# Altium project CM4 IO_V1.10.PrjPcb (part 4 of 5)

## Sheet 16 MIPI DSI TX.SchDoc: CM4 IO
size 420 x 297 mm; Page Create Date: March  8, 1995; Page Number: 16; Page Size: A3; Comment: radxa_1010; Page Count: 19; RevCode: V1.10; Doc: 16 MIPI DSI TX; DsnPath: D:\WMS\黄工\[RC126]CM4_IO_V1.10\[RC126]_V1.10\CM4 IO_V1.10.DSN; SchematicName: CM4 IO V1.10; PageName: 16 MIPI DSI TX; PageSize: A3; TopSchematic: True
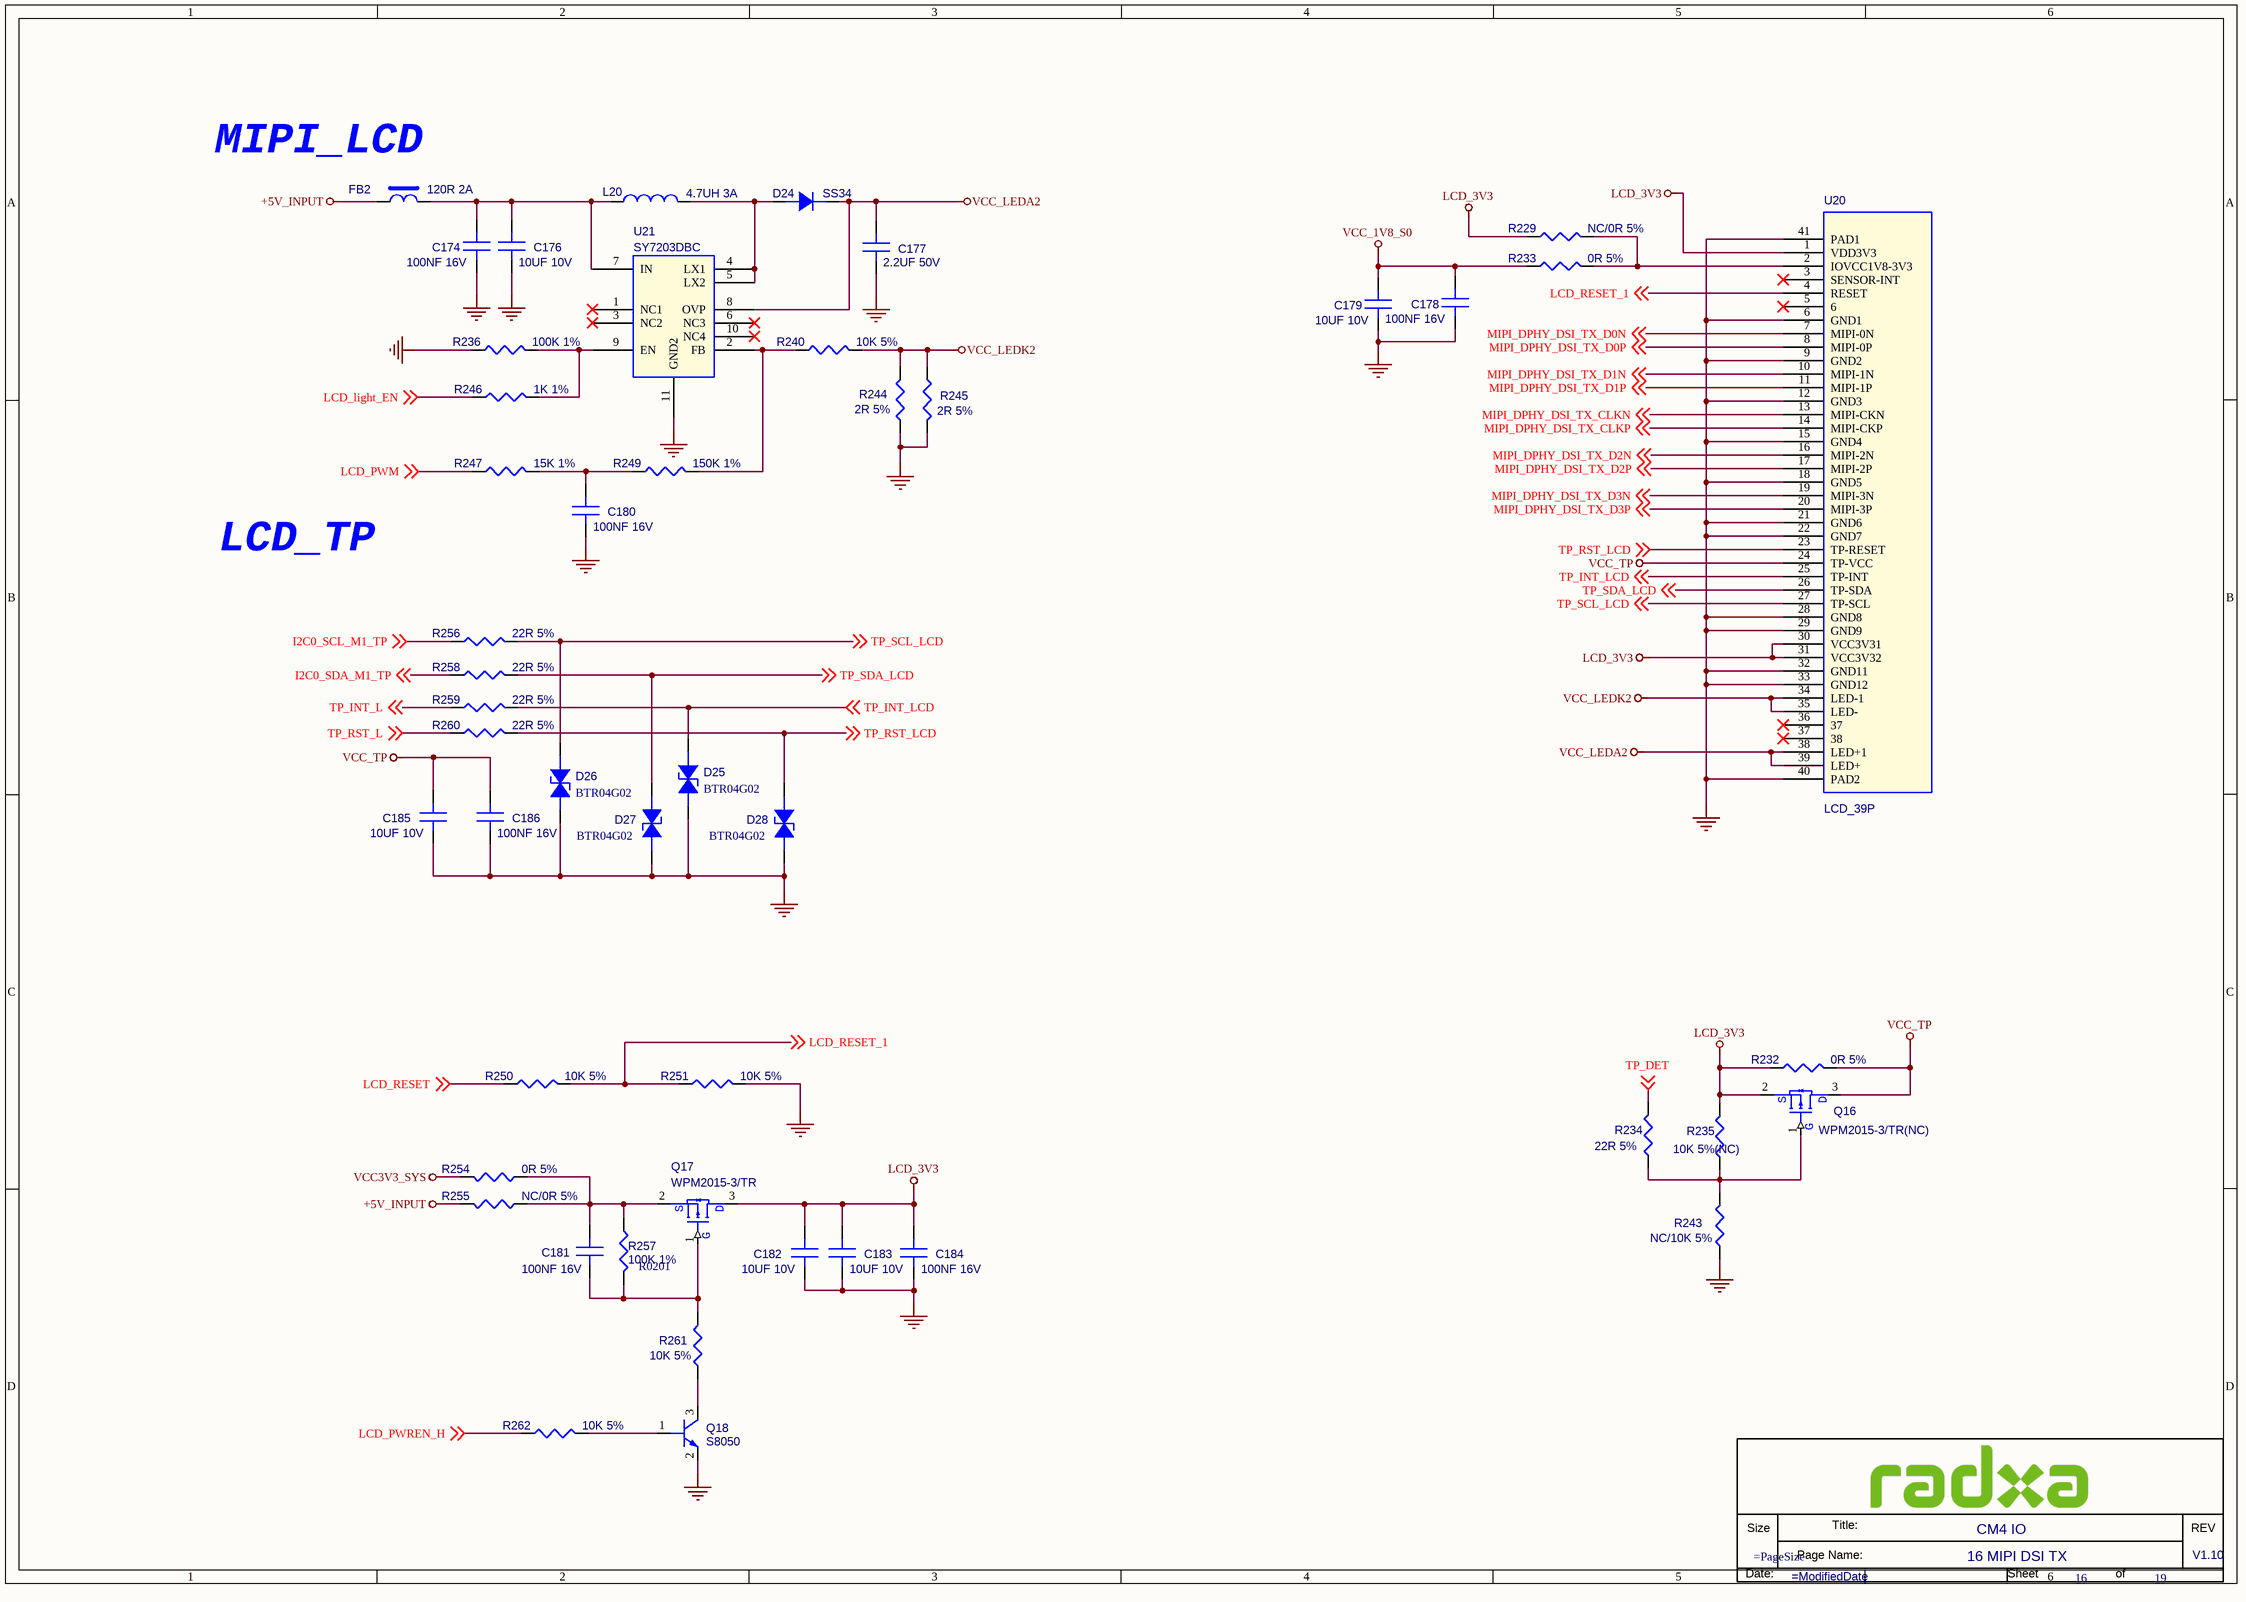
[diagram p13: 16 MIPI DSI TX.SchDoc]

### Parts
(Parts that share a designator on the sheet are numbered #1, #2 ... from top to bottom, then left to right.)
*#14  Doc: 16 MIPI DSI TX  RevCode: V1.10  Title: CM4 IO  Page Number: 16  Page Count: 19  (hidden comment: radxa_1010)  (graphical)
C174  100NF 16V  [C0201]
C176  10UF 10V  [C0603]
C177  2.2UF 50V  [C0603]
C178  100NF 16V  [C0201]
C179  10UF 10V  [C0603]
C180  100NF 16V  [C0201]
C181  100NF 16V  [C0201]
C182  10UF 10V  [C0603]
C183  10UF 10V  [C0603]
C184  100NF 16V  [C0201]
C185  10UF 10V  [C0603]
C186  100NF 16V  [C0201]
D24  SS34  [DO_214AC]
D25  BTR04G02  [DFN1006-2L]
D26  BTR04G02  [DFN1006-2L]
D27  BTR04G02  [DFN1006-2L]
D28  BTR04G02  [DFN1006-2L]
FB2  120R 2A  [FB0603]
L20  4.7UH 3A  [L_3015]
Q16  WPM2015-3/TR(NC)  [SOT_23]
Q17  WPM2015-3/TR  [SOT_23]
Q18  S8050  [SOT_23]
R229  NC/0R 5%  [R0402]
R232  0R 5%  [R0402]
R233  0R 5%  [R0402]
R234  22R 5%  [R0402]
R235  10K 5%(NC)  [R0402]
R236  100K 1%  [R0402]
R240  10K 5%  [R0402]
R243  NC/10K 5%  [R0402]
R244  2R 5%  [R0402]
R245  2R 5%  [R0402]
R246  1K 1%  [R0402]
R247  15K 1%  [R0402]
R249  150K 1%  [R0402]
R250  10K 5%  [R0402]
R251  10K 5%  [R0402]
R254  0R 5%  [R0402]
R255  NC/0R 5%  [R0402]
R256  22R 5%  [R0402]
R257  100K 1%  PCB Footprint: R0201  [R0402]
R258  22R 5%  [R0402]
R259  22R 5%  [R0402]
R260  22R 5%  [R0402]
R261  10K 5%  [R0402]
R262  10K 5%  [R0402]
U20  LCD_39P  [FPC_39P_0D3_LIE]
U21  SY7203DBC  [DFN10_0D5_3]

### Nets
+5V_INPUT: FB2.1 R255.1
GND: C174.2(B) C176.2(B) C177.2(B) C178.2(B) C179.2(B) C180.1(A) C182.2(B) C183.2(B) C184.2(B) C185.2(B) C186.2(B) D25.2(CATHODE) D26.2(CATHODE) D27.2(CATHODE) D28.2(CATHODE) Q18.2(EMITTER) R236.1 R243.1 R244.2 R245.2 R251.2 U20.6(GND1) U20.9(GND2) U20.12(GND3) U20.15(GND4) U20.18(GND5) U20.21(GND6) U20.22(GND7) U20.28(GND8) U20.29(GND9) U20.32(GND11) U20.33(GND12) U20.40(PAD2) U20.41(PAD1) U21.11(GND2)
LCD_3V3: C182.1(A) C183.1(A) C184.1(A) Q16.2(S) Q17.3(D) R229.1 R232.1 R235.2 U20.1(VDD3V3) U20.30(VCC3V31) U20.31(VCC3V32)
VCC3V3_SYS: R254.1
VCC_1V8_S0: C178.1(A) C179.1(A) R233.1
VCC_LEDA2: C177.1(A) D24.2(K) U20.38(LED+1) U20.39(LED+) U21.8(OVP)
VCC_LEDK2: R240.2 R244.1 R245.1 U20.34(LED-1) U20.35(LED-)
VCC_TP: C185.1(A) C186.1(A) Q16.3(D) R232.2 U20.24(TP-VCC)
I2C0_SCL_M1_TP: R256.1 ; off-sheet I2C0_SCL_M1_TP
I2C0_SDA_M1_TP: R258.1 ; off-sheet I2C0_SDA_M1_TP
LCD_light_EN: R246.1 ; off-sheet LCD_light_EN
LCD_PWM: R247.1 ; off-sheet LCD_PWM
LCD_PWREN_H: R262.1 ; off-sheet LCD_PWREN_H
LCD_RESET: R250.1 ; off-sheet LCD_RESET
LCD_RESET_1: R250.2 R251.1 U20.4(RESET) ; off-sheet LCD_RESET_1
MIPI_DPHY_DSI_TX_CLKN: U20.13(MIPI-CKN) ; off-sheet MIPI_DPHY_DSI_TX_CLKN
MIPI_DPHY_DSI_TX_CLKP: U20.14(MIPI-CKP) ; off-sheet MIPI_DPHY_DSI_TX_CLKP
MIPI_DPHY_DSI_TX_D0N: U20.7(MIPI-0N) ; off-sheet MIPI_DPHY_DSI_TX_D0N
MIPI_DPHY_DSI_TX_D0P: U20.8(MIPI-0P) ; off-sheet MIPI_DPHY_DSI_TX_D0P
MIPI_DPHY_DSI_TX_D1N: U20.10(MIPI-1N) ; off-sheet MIPI_DPHY_DSI_TX_D1N
MIPI_DPHY_DSI_TX_D1P: U20.11(MIPI-1P) ; off-sheet MIPI_DPHY_DSI_TX_D1P
MIPI_DPHY_DSI_TX_D2N: U20.16(MIPI-2N) ; off-sheet MIPI_DPHY_DSI_TX_D2N
MIPI_DPHY_DSI_TX_D2P: U20.17(MIPI-2P) ; off-sheet MIPI_DPHY_DSI_TX_D2P
MIPI_DPHY_DSI_TX_D3N: U20.19(MIPI-3N) ; off-sheet MIPI_DPHY_DSI_TX_D3N
MIPI_DPHY_DSI_TX_D3P: U20.20(MIPI-3P) ; off-sheet MIPI_DPHY_DSI_TX_D3P
TP_DET: R234.1 ; off-sheet TP_DET
TP_INT_L: R259.1 ; off-sheet TP_INT_L
TP_INT_LCD: D25.1(ANODE) R259.2 U20.25(TP-INT) ; off-sheet TP_INT_LCD
TP_RST_L: R260.1 ; off-sheet TP_RST_L
TP_RST_LCD: D28.1(ANODE) R260.2 U20.23(TP-RESET) ; off-sheet TP_RST_LCD
TP_SCL_LCD: D26.1(ANODE) R256.2 U20.27(TP-SCL) ; off-sheet TP_SCL_LCD
TP_SDA_LCD: D27.1(ANODE) R258.2 U20.26(TP-SDA) ; off-sheet TP_SDA_LCD
NetC174_1: C174.1(A) C176.1(A) FB2.2 L20.1 U21.7(IN)
NetC180_2: C180.2(B) R247.2 R249.1
NetC181_1: C181.1(A) Q17.2(S) R254.2 R255.2 R257.1
NetC181_2: C181.2(B) Q17.1(G) R257.2 R261.1
NetD24_1: D24.1(A) L20.2 U21.4(LX1) U21.5(LX2)
NetQ16_1: Q16.1(G) R234.2 R235.1 R243.2
NetQ18_1: Q18.1(BASE) R262.2
NetQ18_3: Q18.3(COLLECTOR) R261.2
NetR229_2: R229.2 R233.2 U20.2(IOVCC1V8-3V3)
NetR236_2: R236.2 R246.2 U21.9(EN)
NetR240_1: R240.1 R249.2 U21.2(FB)

Not connected (* = marked no-connect by the designer): U20 3(SENSOR-INT)* 5(6)* 36(37)* 37(38)*; U21 1(NC1)* 3(NC2)* 6(NC3)* 10(NC4)*

### Notes on the sheet
- (near FB2) MIPI_LCD
- LCD_TP
- (in symbol radxa_1010) Size; Title:; REV; Page Name:; Date:; Sheet; of

### Library data of the parts
C174 = C: SMD  0201  100NF  16V  X5R  ±20%  ROHS; PARTS: 1; Part Reference: C174; Part Number: A1C01.00099; OriginalSymbolOrigin: (0,30); PKG_TYPE: CAP2-100-250; LEVEL: STD; PINSWAP: (A,B); Preferred: 6715f349cd0bc5; Value: 100NF 16V; Part Type: 陶瓷电容
C176 = C: SMD  0603  10UF  10V  X5R  ±10%  ROHS; PARTS: 1; Part Reference: C176; Part Number: A1C01.00270; OriginalSymbolOrigin: (0,30); PKG_TYPE: CAP2-100-250; LEVEL: STD; PINSWAP: (A,B); Value: 10UF 10V; PCB Footprint: C0603; Part Type: 陶瓷电容
C177 = C: SMD  0603  2.2UF  50V  X5R  ±10%  ROHS; PARTS: 1; Part Reference: C177; Part Number: A1C01.00235; OriginalSymbolOrigin: (0,30); PKG_TYPE: CAP2-100-250; LEVEL: STD; PINSWAP: (A,B); Value: 2.2UF 50V; PCB Footprint: C0603; Part Type: 陶瓷电容
C178 = C: SMD  0201  100NF  16V  X5R  ±20%  ROHS; PARTS: 1; Part Reference: C178; Part Number: A1C01.00099; OriginalSymbolOrigin: (0,30); PKG_TYPE: CAP2-100-250; LEVEL: STD; PINSWAP: (A,B); Preferred: 6715f349cd0bc5; Value: 100NF 16V; Part Type: 陶瓷电容
C179 = C: SMD  0603  10UF  10V  X5R  ±10%  ROHS; PARTS: 1; Part Reference: C179; Part Number: A1C01.00270; OriginalSymbolOrigin: (0,30); PKG_TYPE: CAP2-100-250; LEVEL: STD; PINSWAP: (A,B); Value: 10UF 10V; PCB Footprint: C0603; Part Type: 陶瓷电容
C180 = C: SMD  0201  100NF  16V  X5R  ±20%  ROHS; PARTS: 1; Part Reference: C180; Part Number: A1C01.00099; OriginalSymbolOrigin: (0,30); PKG_TYPE: CAP2-100-250; LEVEL: STD; PINSWAP: (A,B); Preferred: 6715f349cd0bc5; Value: 100NF 16V; Part Type: 陶瓷电容
C181 = C: SMD  0201  100NF  16V  X5R  ±20%  ROHS; PARTS: 1; Part Reference: C181; Part Number: A1C01.00099; OriginalSymbolOrigin: (0,30); PKG_TYPE: CAP2-100-250; LEVEL: STD; PINSWAP: (A,B); Preferred: 6715f349cd0bc5; Value: 100NF 16V; Part Type: 陶瓷电容
C182 = C: SMD  0603  10UF  10V  X5R  ±10%  ROHS; PARTS: 1; Part Reference: C182; Part Number: A1C01.00270; OriginalSymbolOrigin: (0,30); PKG_TYPE: CAP2-100-250; LEVEL: STD; PINSWAP: (A,B); Value: 10UF 10V; PCB Footprint: C0603; Part Type: 陶瓷电容
C183 = C: SMD  0603  10UF  10V  X5R  ±10%  ROHS; PARTS: 1; Part Reference: C183; Part Number: A1C01.00270; OriginalSymbolOrigin: (0,30); PKG_TYPE: CAP2-100-250; LEVEL: STD; PINSWAP: (A,B); Value: 10UF 10V; PCB Footprint: C0603; Part Type: 陶瓷电容
C184 = C: SMD  0201  100NF  16V  X5R  ±20%  ROHS; PARTS: 1; Part Reference: C184; Part Number: A1C01.00099; OriginalSymbolOrigin: (0,30); PKG_TYPE: CAP2-100-250; LEVEL: STD; PINSWAP: (A,B); Preferred: 6715f349cd0bc5; Value: 100NF 16V; Part Type: 陶瓷电容; PCB Footprint: C0201
C185 = C: SMD  0603  10UF  10V  X5R  ±10%  ROHS; PARTS: 1; Part Reference: C185; Part Number: A1C01.00270; OriginalSymbolOrigin: (0,30); PKG_TYPE: CAP2-100-250; LEVEL: STD; PINSWAP: (A,B); Value: 10UF 10V; PCB Footprint: C0603; Part Type: 陶瓷电容
C186 = C: SMD  0201  100NF  16V  X5R  ±20%  ROHS; PARTS: 1; Part Reference: C186; Part Number: A1C01.00099; OriginalSymbolOrigin: (0,30); PKG_TYPE: CAP2-100-250; LEVEL: STD; PINSWAP: (A,B); Preferred: 6715f349cd0bc5; Value: 100NF 16V; Part Type: 陶瓷电容
D24 = DIODE: SMD  编带  DO-214AC  SS34  CJ  ROHS; Part Reference: D24; Part Number: A1D02.00052; Value: SS34; Part Type: 二极管-ESD管-桥堆-TVS管; PCB Footprint: DO_214AC
D25 = ESD: SMD  编带  0402  BTR04G02  B-tron  ROHS; Part Reference: D25; Part Number: A1D02.00002; Parameter: ESD-台舟 ESD5341N-封装 esd0402; ID: DE-E0004; PCB Footprint: ESD_D0402; Temp Coeff: -50℃ ~ +125℃; Value: BTR04G02; Part Type: 二极管-ESD管-桥堆-TVS管
D26 = ESD: SMD  编带  0402  BTR04G02  B-tron  ROHS; Part Reference: D26; Part Number: A1D02.00002; Parameter: ESD-台舟 ESD5341N-封装 esd0402; ID: DE-E0004; PCB Footprint: ESD_D0402; Temp Coeff: -50℃ ~ +125℃; Value: BTR04G02; Part Type: 二极管-ESD管-桥堆-TVS管
D27 = ESD: SMD  编带  0402  BTR04G02  B-tron  ROHS; Part Reference: D27; Part Number: A1D02.00002; Parameter: ESD-台舟 ESD5341N-封装 esd0402; ID: DE-E0004; PCB Footprint: ESD_D0402; Temp Coeff: -50℃ ~ +125℃; Value: BTR04G02; Part Type: 二极管-ESD管-桥堆-TVS管
D28 = ESD: SMD  编带  0402  BTR04G02  B-tron  ROHS; Part Reference: D28; Part Number: A1D02.00002; Parameter: ESD-台舟 ESD5341N-封装 esd0402; ID: DE-E0004; PCB Footprint: ESD_D0402; Temp Coeff: -50℃ ~ +125℃; Value: BTR04G02; Part Type: 二极管-ESD管-桥堆-TVS管
FB2 = BEAD: SMD  0603  FB120R  2A  PZ1608U121-2R0TF  ±25%  Sunlord(顺络)  ROHS; Part Reference: FB2; Part Number: A1L09.00003; Temp Coeff: -55℃~+125℃; PCB Footprint: FB0603; Value: 120R 2A; Part Type: 贴片磁珠
L20 = L: SMD  带屏蔽  3*3*1.5mm  4.7UH  3A  ±20%  RXWHJ3015-4R7MT  ROHS; Part Reference: L20; Part Number: A1L01.00021; PCB Footprint: L_3015; Value: 4.7UH 3A; Part Type: 贴片功率电感
Q16 = MOSFET_PNP: SMD编带  SOT-23  WPM2015-3/TR  P沟道  ROHS; Part Reference: Q16; Part Number: A1D01.00019; Temp Coeff: -55℃ to ＋150℃; Value: WPM2015-3/TR(NC); Part Type: 三极管-MOS管; PCB Footprint: SOT_23
Q17 = MOSFET_PNP: SMD编带  SOT-23  WPM2015-3/TR  P沟道  ROHS; Part Reference: Q17; Part Number: A1D01.00019; Temp Coeff: -55℃ to ＋150℃; Value: WPM2015-3/TR; PCB Footprint: SOT_23; Part Type: 三极管-MOS管
Q18 = NPN: SMD编带  SOT-23  S8050  NPN  ROHS; Part Reference: Q18; Part Number: A1D01.00009; Manufacturer PN: S8050_SOT23; Manufacturer: 长电; Temp Coeff: -55℃ to ＋150℃; Pc: 0.3W; Vceo: 25V; Ic: 0.5A; Priority: A; PCB Footprint: SOT_23; Value: S8050; Created by: JJJ; Part Type: 三极管-MOS管; RK PN: S8050
R229 = R: SMD  0201  0R  1/20W  ±5%  ROHS; Part Reference: R229; Part Number: A1R01.00027; PCB Footprint: R0201; Temp Coeff: －55℃ ~ ＋125℃; Value: NC/0R 5%; Part Type: 贴片电阻
R232 = R: SMD  0201  0R  1/20W  ±5%  ROHS; Part Reference: R232; Part Number: A1R01.00027; PCB Footprint: R0201; Temp Coeff: －55℃ ~ ＋125℃; Value: 0R 5%; Part Type: 贴片电阻
R233 = R: SMD  0201  0R  1/20W  ±5%  ROHS; Part Reference: R233; Part Number: A1R01.00027; PCB Footprint: R0201; Temp Coeff: －55℃ ~ ＋125℃; Value: 0R 5%; Part Type: 贴片电阻
R234 = R: SMD  0201  22R  1/20W  ±5%  ROHS; Part Reference: R234; Part Number: A1R01.00024; PCB Footprint: R0201; Value: 22R 5%; Part Type: 贴片电阻
R235 = R: SMD  0201  10K  1/20W  ±5%  ROHS; Part Reference: R235; Part Number: A1R01.00012; PCB Footprint: R0201; Temp Coeff: －55℃ ~ ＋125℃; Value: 10K 5%(NC); Part Type: 贴片电阻
R236 = R: SMD  0201  100K  1/20W  ±1%  ROHS; Part Reference: R236; Part Number: A1R01.00165; Preferred: 6715f349cd0bc5; Value: 100K 1%; Part Type: 贴片电阻
R240 = R: SMD  0201  10K  1/20W  ±5%  ROHS; Part Reference: R240; Part Number: A1R01.00012; PCB Footprint: R0201; Temp Coeff: －55℃ ~ ＋125℃; Value: 10K 5%; Part Type: 贴片电阻
R243 = R: SMD  0201  10K  1/20W  ±5%  ROHS; Part Reference: R243; Part Number: A1R01.00012; PCB Footprint: R0201; Temp Coeff: －55℃ ~ ＋125℃; Value: NC/10K 5%; Part Type: 贴片电阻
R244 = R: SMD  0603  2R  1/10W  ±5%  ROHS; Part Reference: R244; Part Number: A1R01.00329; PCB Footprint: R0603; Value: 2R 5%; Part Type: 贴片电阻
R245 = R: SMD  0603  2R  1/10W  ±5%  ROHS; Part Reference: R245; Part Number: A1R01.00329; PCB Footprint: R0603; Value: 2R 5%; Part Type: 贴片电阻
R246 = R: SMD  0201  1K  1/20W  ±1%  ROHS; Part Reference: R246; Part Number: A1R01.00111; PCB Footprint: R0201; Value: 1K 1%; Part Type: 贴片电阻
R247 = R: SMD  0201  15K  1/20W  ±1%  ROHS; Part Reference: R247; Part Number: A1R01.00119; PCB Footprint: R0201; Value: 15K 1%; Part Type: 贴片电阻
R249 = R: SMD  0201  150K  1/20W  ±1%  ROHS; Part Reference: R249; Part Number: A1R01.00095; PCB Footprint: R0201; Value: 150K 1%; Part Type: 贴片电阻
R250 = R: SMD  0201  10K  1/20W  ±5%  ROHS; Part Reference: R250; Part Number: A1R01.00012; PCB Footprint: R0201; Temp Coeff: －55℃ ~ ＋125℃; Value: 10K 5%; Part Type: 贴片电阻
R251 = R: SMD  0201  10K  1/20W  ±5%  ROHS; Part Reference: R251; Part Number: A1R01.00012; PCB Footprint: R0201; Temp Coeff: －55℃ ~ ＋125℃; Value: 10K 5%; Part Type: 贴片电阻
R254 = R: SMD  0402  0R  1/16W  ±5%  ROHS; Part Reference: R254; Part Number: A1R01.00030; PCB Footprint: R0402; Value: 0R 5%; Part Type: 贴片电阻
R255 = R: SMD  0201  0R  1/20W  ±5%  ROHS; Part Reference: R255; Part Number: A1R01.00027; PCB Footprint: R0201; Temp Coeff: －55℃ ~ ＋125℃; Value: NC/0R 5%; Part Type: 贴片电阻
R256 = R: SMD  0201  22R  1/20W  ±5%  ROHS; Part Reference: R256; Part Number: A1R01.00024; PCB Footprint: R0201; Value: 22R 5%; Part Type: 贴片电阻
R257 = R: SMD  0201  100K  1/20W  ±1%  ROHS; Part Reference: R257; Part Number: A1R01.00165; Preferred: 6715f349cd0bc5; Value: 100K 1%; Part Type: 贴片电阻
R258 = R: SMD  0201  22R  1/20W  ±5%  ROHS; Part Reference: R258; Part Number: A1R01.00024; PCB Footprint: R0201; Value: 22R 5%; Part Type: 贴片电阻
R259 = R: SMD  0201  22R  1/20W  ±5%  ROHS; Part Reference: R259; Part Number: A1R01.00024; PCB Footprint: R0201; Value: 22R 5%; Part Type: 贴片电阻
R260 = R: SMD  0201  22R  1/20W  ±5%  ROHS; Part Reference: R260; Part Number: A1R01.00024; PCB Footprint: R0201; Value: 22R 5%; Part Type: 贴片电阻
R261 = R: SMD  0201  10K  1/20W  ±5%  ROHS; Part Reference: R261; Part Number: A1R01.00012; PCB Footprint: R0201; Temp Coeff: －55℃ ~ ＋125℃; Value: 10K 5%; Part Type: 贴片电阻
R262 = R: SMD  0201  10K  1/20W  ±5%  ROHS; Part Reference: R262; Part Number: A1R01.00012; PCB Footprint: R0201; Temp Coeff: －55℃ ~ ＋125℃; Value: 10K 5%; Part Type: 贴片电阻
U20 = LCD_39P: SMD  下接触  卧式  39PIN  0.3mm脚距  后翻盖H1.0  FH35C-39S-0.3SHW(50)  镀金  广濑  ROHS; Part Reference: U20; Part Number: A1J06.00001; Value: LCD_39P; PCB Footprint: FPC_39P_0D3_LIE; Part Type: FPC座
U21 = SY7203DBC: SMD  升压  SY7203DBC  DFN3X3-10  silergy(矽力杰)  ROHS; Part Reference: U21; Part Number: A1I01.00260; PCB Footprint: DFN10_0D5_3; Value: SY7203DBC; Part Type: 集成电路/模块
*#14 = radxa_1010: Page Create Date: March  8, 1995; Page Size: =PageSize; Page Modify Date: =ModifiedDate

## Sheet 17 MIPI_CSI_RX.SchDoc: CM4 IO
size 420 x 297 mm; Page Create Date: March  8, 1995; Page Number: 17; Page Size: A3; Comment: radxa_1010; Page Count: 19; RevCode: V1.10; Doc: 17 MIPI_CSI_RX; DsnPath: D:\WMS\黄工\[RC126]CM4_IO_V1.10\[RC126]_V1.10\CM4 IO_V1.10.DSN; SchematicName: CM4 IO V1.10; PageName: 17 MIPI_CSI_RX; PageSize: A3; TopSchematic: True
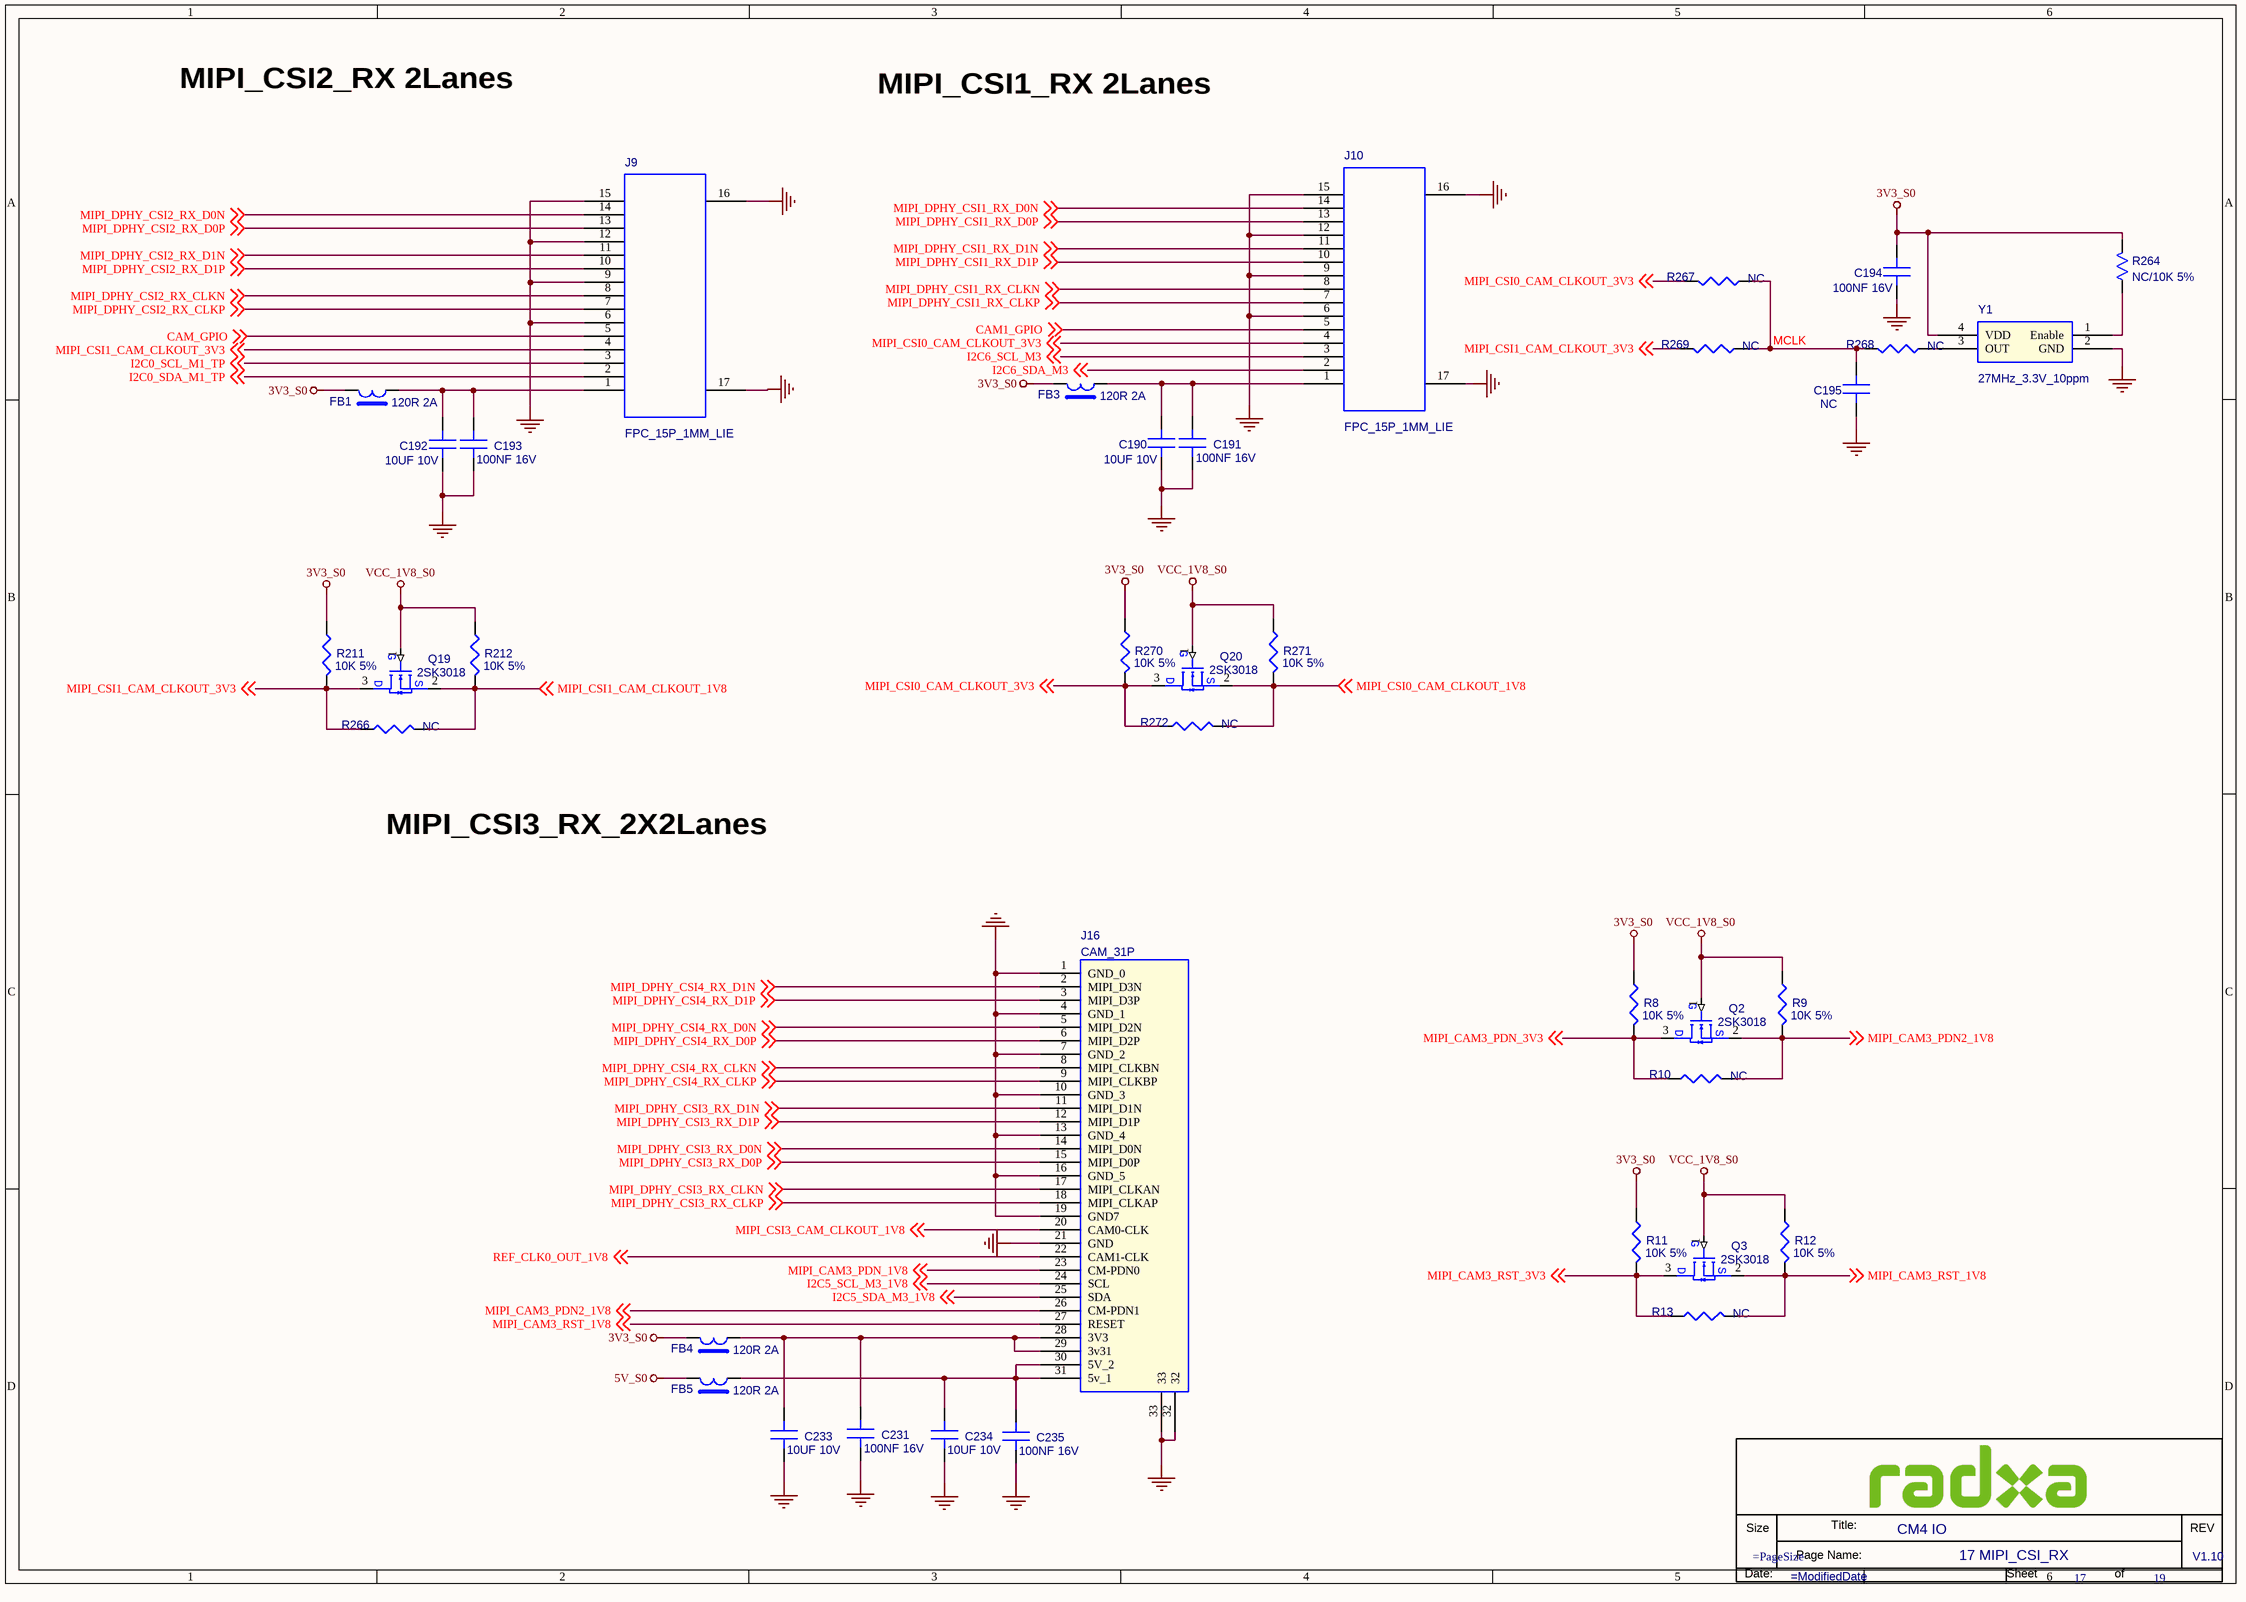
[diagram p14: 17 MIPI_CSI_RX.SchDoc]

### Parts
(Parts that share a designator on the sheet are numbered #1, #2 ... from top to bottom, then left to right.)
*#15  Doc: 17 MIPI_CSI_RX  RevCode: V1.10  Title: CM4 IO  Page Number: 17  Page Count: 19  (hidden comment: radxa_1010)  (graphical)
C190  10UF 10V  [C0402]
C191  100NF 16V  [C0201]
C192  10UF 10V  [C0402]
C193  100NF 16V  [C0201]
C194  100NF 16V  [C0201]
C195  NC  [C0201]
C231  100NF 16V  [C0201]
C233  10UF 10V  [C0402]
C234  10UF 10V  [C0402]
C235  100NF 16V  [C0201]
FB1  120R 2A  [FB0402]
FB3  120R 2A  [FB0402]
FB4  120R 2A  [FB0402]
FB5  120R 2A  [FB0402]
J9  FPC_15P_1MM_LIE  [FPC_15_1D0_LIE]
J10  FPC_15P_1MM_LIE  [FPC_15_1D0_LIE]
J16  CAM_31P  [FPC_31P_0d3_LIE]
Q2  2SK3018  [SOT_323]
Q3  2SK3018  [SOT_323]
Q19  2SK3018  [SOT_323]
Q20  2SK3018  [SOT_323]
R8  10K 5%  [R0402]
R9  10K 5%  [R0402]
R10  NC  [R0402]
R11  10K 5%  [R0402]
R12  10K 5%  [R0402]
R13  NC  [R0402]
R211  10K 5%  [R0402]
R212  10K 5%  [R0402]
R264  NC/10K 5%  [R0201]
R266  NC  [R0402]
R267  NC  [R0402]
R268  NC  [R0402]
R269  NC  [R0402]
R270  10K 5%  [R0402]
R271  10K 5%  [R0402]
R272  NC  [R0402]
Y1  27MHz_3.3V_10ppm  [Y-4-5_08-TXC-7W5]

### Nets
3V3_S0: C194.1 FB1.2 FB3.2 FB4.2 R8.2 R11.2 R211.2 R264.2 R270.2 Y1.4(VDD)
5V_S0: FB5.2
GND: C190.2(B) C191.2(B) C192.2(B) C193.2(B) C194.2 C195.2 C231.2(B) C233.2(B) C234.2(B) C235.2(B) J9.6 J9.9 J9.12 J9.15 J9.16 J9.17 J10.6 J10.9 J10.12 J10.15 J10.16 J10.17 J16.1(GND_0) J16.4(GND_1) J16.7(GND_2) J16.10(GND_3) J16.13(GND_4) J16.16(GND_5) J16.19(GND7) J16.21(GND) J16.32 J16.33 Y1.2(GND)
VCC_1V8_S0: Q2.1(G) Q3.1(G) Q19.1(G) Q20.1(G) R9.2 R12.2 R212.2 R271.2
CAM1_GPIO: J10.5 ; off-sheet CAM1_GPIO
CAM_GPIO: J9.5 ; off-sheet CAM_GPIO
I2C0_SCL_M1_TP: J9.3 ; off-sheet I2C0_SCL_M1_TP
I2C0_SDA_M1_TP: J9.2 ; off-sheet I2C0_SDA_M1_TP
I2C5_SCL_M3_1V8: J16.24(SCL) ; off-sheet I2C5_SCL_M3_1V8
I2C5_SDA_M3_1V8: J16.25(SDA) ; off-sheet I2C5_SDA_M3_1V8
I2C6_SCL_M3: J10.3 ; off-sheet I2C6_SCL_M3
I2C6_SDA_M3: J10.2 ; off-sheet I2C6_SDA_M3
MCLK: C195.1 R267.1 R268.1 R269.1
MIPI_CAM3_PDN2_1V8: J16.26(CM-PDN1) Q2.2(S) R9.1 R10.1 ; off-sheet MIPI_CAM3_PDN2_1V8
MIPI_CAM3_PDN_1V8: J16.23(CM-PDN0) ; off-sheet MIPI_CAM3_PDN_1V8
MIPI_CAM3_PDN_3V3: Q2.3(D) R8.1 R10.2 ; off-sheet MIPI_CAM3_PDN_3V3
MIPI_CAM3_RST_1V8: J16.27(RESET) Q3.2(S) R12.1 R13.1 ; off-sheet MIPI_CAM3_RST_1V8
MIPI_CAM3_RST_3V3: Q3.3(D) R11.1 R13.2 ; off-sheet MIPI_CAM3_RST_3V3
MIPI_CSI0_CAM_CLKOUT_1V8: Q20.2(S) R271.1 R272.1 ; off-sheet MIPI_CSI0_CAM_CLKOUT_1V8
MIPI_CSI0_CAM_CLKOUT_3V3: J10.4 Q20.3(D) R267.2 R270.1 R272.2 ; off-sheet MIPI_CSI0_CAM_CLKOUT_3V3
MIPI_CSI1_CAM_CLKOUT_1V8: Q19.2(S) R212.1 R266.1 ; off-sheet MIPI_CSI1_CAM_CLKOUT_1V8
MIPI_CSI1_CAM_CLKOUT_3V3: J9.4 Q19.3(D) R211.1 R266.2 R269.2 ; off-sheet MIPI_CSI1_CAM_CLKOUT_3V3
MIPI_CSI3_CAM_CLKOUT_1V8: J16.20(CAM0-CLK) ; off-sheet MIPI_CSI3_CAM_CLKOUT_1V8
MIPI_DPHY_CSI1_RX_CLKN: J10.8 ; off-sheet MIPI_DPHY_CSI1_RX_CLKN
MIPI_DPHY_CSI1_RX_CLKP: J10.7 ; off-sheet MIPI_DPHY_CSI1_RX_CLKP
MIPI_DPHY_CSI1_RX_D0N: J10.14 ; off-sheet MIPI_DPHY_CSI1_RX_D0N
MIPI_DPHY_CSI1_RX_D0P: J10.13 ; off-sheet MIPI_DPHY_CSI1_RX_D0P
MIPI_DPHY_CSI1_RX_D1N: J10.11 ; off-sheet MIPI_DPHY_CSI1_RX_D1N
MIPI_DPHY_CSI1_RX_D1P: J10.10 ; off-sheet MIPI_DPHY_CSI1_RX_D1P
MIPI_DPHY_CSI2_RX_CLKN: J9.8 ; off-sheet MIPI_DPHY_CSI2_RX_CLKN
MIPI_DPHY_CSI2_RX_CLKP: J9.7 ; off-sheet MIPI_DPHY_CSI2_RX_CLKP
MIPI_DPHY_CSI2_RX_D0N: J9.14 ; off-sheet MIPI_DPHY_CSI2_RX_D0N
MIPI_DPHY_CSI2_RX_D0P: J9.13 ; off-sheet MIPI_DPHY_CSI2_RX_D0P
MIPI_DPHY_CSI2_RX_D1N: J9.11 ; off-sheet MIPI_DPHY_CSI2_RX_D1N
MIPI_DPHY_CSI2_RX_D1P: J9.10 ; off-sheet MIPI_DPHY_CSI2_RX_D1P
MIPI_DPHY_CSI3_RX_CLKN: J16.17(MIPI_CLKAN) ; off-sheet MIPI_DPHY_CSI3_RX_CLKN
MIPI_DPHY_CSI3_RX_CLKP: J16.18(MIPI_CLKAP) ; off-sheet MIPI_DPHY_CSI3_RX_CLKP
MIPI_DPHY_CSI3_RX_D0N: J16.14(MIPI_D0N) ; off-sheet MIPI_DPHY_CSI3_RX_D0N
MIPI_DPHY_CSI3_RX_D0P: J16.15(MIPI_D0P) ; off-sheet MIPI_DPHY_CSI3_RX_D0P
MIPI_DPHY_CSI3_RX_D1N: J16.11(MIPI_D1N) ; off-sheet MIPI_DPHY_CSI3_RX_D1N
MIPI_DPHY_CSI3_RX_D1P: J16.12(MIPI_D1P) ; off-sheet MIPI_DPHY_CSI3_RX_D1P
MIPI_DPHY_CSI4_RX_CLKN: J16.8(MIPI_CLKBN) ; off-sheet MIPI_DPHY_CSI4_RX_CLKN
MIPI_DPHY_CSI4_RX_CLKP: J16.9(MIPI_CLKBP) ; off-sheet MIPI_DPHY_CSI4_RX_CLKP
MIPI_DPHY_CSI4_RX_D0N: J16.5(MIPI_D2N) ; off-sheet MIPI_DPHY_CSI4_RX_D0N
MIPI_DPHY_CSI4_RX_D0P: J16.6(MIPI_D2P) ; off-sheet MIPI_DPHY_CSI4_RX_D0P
MIPI_DPHY_CSI4_RX_D1N: J16.2(MIPI_D3N) ; off-sheet MIPI_DPHY_CSI4_RX_D1N
MIPI_DPHY_CSI4_RX_D1P: J16.3(MIPI_D3P) ; off-sheet MIPI_DPHY_CSI4_RX_D1P
REF_CLK0_OUT_1V8: J16.22(CAM1-CLK) ; off-sheet REF_CLK0_OUT_1V8
NetC190_1: C190.1(A) C191.1(A) FB3.1 J10.1
NetC192_1: C192.1(A) C193.1(A) FB1.1 J9.1
NetC231_1: C231.1(A) C233.1(A) FB4.1 J16.28(3V3) J16.29(3v31)
NetC234_1: C234.1(A) C235.1(A) FB5.1 J16.30(5V_2) J16.31(5v_1)
NetR264_1: R264.1 Y1.1(Enable)
NetR268_2: R268.2 Y1.3(OUT)

### Notes on the sheet
- MIPI_CSI2_RX 2Lanes
- MIPI_CSI1_RX 2Lanes
- MIPI_CSI3_RX_2X2Lanes
- (in symbol radxa_1010) Size; Title:; REV; Page Name:; Date:; Sheet; of

### Library data of the parts
C190 = C: SMD  0402  10UF  10V  X5R  ±20%  ROHS; PARTS: 1; Part Reference: C190; Part Number: A1C01.00025; OriginalSymbolOrigin: (0,30); PKG_TYPE: CAP2-100-250; LEVEL: STD; PINSWAP: (A,B); Preferred: 6715f349cd0bc5; Value: 10UF 10V; Part Type: 陶瓷电容; PCB Footprint: C0402
C191 = C: SMD  0201  100NF  16V  X5R  ±20%  ROHS; PARTS: 1; Part Reference: C191; Part Number: A1C01.00099; OriginalSymbolOrigin: (0,30); PKG_TYPE: CAP2-100-250; LEVEL: STD; PINSWAP: (A,B); Preferred: 6715f349cd0bc5; Value: 100NF 16V; Part Type: 陶瓷电容; PCB Footprint: C0201
C192 = C: SMD  0402  10UF  10V  X5R  ±20%  ROHS; PARTS: 1; Part Reference: C192; Part Number: A1C01.00025; OriginalSymbolOrigin: (0,30); PKG_TYPE: CAP2-100-250; LEVEL: STD; PINSWAP: (A,B); Preferred: 6715f349cd0bc5; Value: 10UF 10V; Part Type: 陶瓷电容; PCB Footprint: C0402
C193 = C: SMD  0201  100NF  16V  X5R  ±20%  ROHS; PARTS: 1; Part Reference: C193; Part Number: A1C01.00099; OriginalSymbolOrigin: (0,30); PKG_TYPE: CAP2-100-250; LEVEL: STD; PINSWAP: (A,B); Preferred: 6715f349cd0bc5; Value: 100NF 16V; Part Type: 陶瓷电容
C194 = C_Dup1: SMD  0201  100NF  16V  X5R  ±20%  ROHS; PARTS: 1; Part Reference: C194; Part Number: A1C01.00099; OriginalSymbolOrigin: (0,30); PKG_TYPE: CAP2-100-250; LEVEL: STD; PINSWAP: (A,B); Preferred: 6715f349cd0bc5; ROOM: DVDD_MEDIA; Grade: B; Approved: 已承认; Value: 100NF 16V; Part Type: 陶瓷电容; PCB Footprint: C0201
C195 = C_Dup1: SMD  0201  10PF  50V  NPO  ±5%  ROHS; PARTS: 1; Part Reference: C195; Part Number: A1C01.00141; OriginalSymbolOrigin: (0,30); PKG_TYPE: CAP2-100-250; LEVEL: STD; PINSWAP: (A,B); Preferred: 6715f349cd0bc5; Approved: 已承认; Grade: B; ROOM: AN41908; Value: NC; Part Type: 陶瓷电容; PCB Footprint: C0201
C231 = C: SMD  0201  100NF  16V  X5R  ±20%  ROHS; PARTS: 1; Part Reference: C231; Part Number: A1C01.00099; OriginalSymbolOrigin: (0,30); PKG_TYPE: CAP2-100-250; LEVEL: STD; PINSWAP: (A,B); Preferred: 6715f349cd0bc5; Value: 100NF 16V; PCB Footprint: C0201; Part Type: 陶瓷电容
C233 = C: SMD  0402  10UF  10V  X5R  ±20%  ROHS; PARTS: 1; Part Reference: C233; Part Number: A1C01.00025; OriginalSymbolOrigin: (0,30); PKG_TYPE: CAP2-100-250; LEVEL: STD; PINSWAP: (A,B); Preferred: 6715f349cd0bc5; Value: 10UF 10V; PCB Footprint: C0402; Part Type: 陶瓷电容
C234 = C: SMD  0402  10UF  10V  X5R  ±20%  ROHS; PARTS: 1; Part Reference: C234; Part Number: A1C01.00025; OriginalSymbolOrigin: (0,30); PKG_TYPE: CAP2-100-250; LEVEL: STD; PINSWAP: (A,B); Preferred: 6715f349cd0bc5; Value: 10UF 10V; PCB Footprint: C0402; Part Type: 陶瓷电容
C235 = C: SMD  0201  100NF  16V  X5R  ±20%  ROHS; PARTS: 1; Part Reference: C235; Part Number: A1C01.00099; OriginalSymbolOrigin: (0,30); PKG_TYPE: CAP2-100-250; LEVEL: STD; PINSWAP: (A,B); Preferred: 6715f349cd0bc5; Value: 100NF 16V; PCB Footprint: C0201; Part Type: 陶瓷电容
FB1 = BEAD: SMD  0402  FB120R  2A  ±25%  ROHS; Part Reference: FB1; Part Number: A1L09.00004; Preferred: 6715f349cd0bc5; Temp Coeff: -55℃ to +125℃; PCB Footprint: FB0402; Value: 120R 2A; Part Type: 贴片磁珠
FB3 = BEAD: SMD  0402  FB120R  2A  ±25%  ROHS; Part Reference: FB3; Part Number: A1L09.00004; Preferred: 6715f349cd0bc5; Temp Coeff: -55℃ to +125℃; PCB Footprint: FB0402; Value: 120R 2A; Part Type: 贴片磁珠
FB4 = BEAD: SMD  0402  FB120R  2A  ±25%  ROHS; Part Reference: FB4; Part Number: A1L09.00004; Temp Coeff: -55℃ to +125℃; Preferred: 6715f349cd0bc5; PCB Footprint: FB0402; Value: 120R 2A; Part Type: 贴片磁珠
FB5 = BEAD: SMD  0402  FB120R  2A  ±25%  ROHS; Part Reference: FB5; Part Number: A1L09.00004; Preferred: 6715f349cd0bc5; Temp Coeff: -55℃ to +125℃; PCB Footprint: FB0402; Value: 120R 2A; Part Type: 贴片磁珠
J9 = FPC_15P_LIE: SMD  翻盖式下接触  卧式  15PIN  180度  1.0mm脚距  H2.0  FPC-1.0FX-15PWCR-H20  XUNPU(讯普)  ROHS; Part Reference: J9; Part Number: A1J06.00025; OriginalSymbolOrigin: (-150,450); Preferred: 6715f349cd0bc5; Temp Coeff: -40℃ to +85℃; ANGLE: ?; ASSEMBLY: ?; EMI_GROUND_TAB: ?; GENDER: ?; LATCHING: ?; MAX_CURRENT: ?; MAX_VOLTAGE: ?; NV_NAME: ?; NV_PN: ?; PACK_TYPE: ?; PATH: ?; PITCH: ?; PLACEMENT_NOTE: ?; REFLOW: ?; SHIELDED: ?; SHROUDED: ?; SKU: COMMON; Value: FPC_15P_1MM_LIE; Part Type: FPC座; PCB Footprint: FPC_15_1D0_LIE
J10 = FPC_15P_LIE: SMD  翻盖式下接触  卧式  15PIN  180度  1.0mm脚距  H2.0  FPC-1.0FX-15PWCR-H20  XUNPU(讯普)  ROHS; Part Reference: J10; Part Number: A1J06.00025; OriginalSymbolOrigin: (-150,450); Temp Coeff: -40℃ to +85℃; Preferred: 6715f349cd0bc5; ANGLE: ?; ASSEMBLY: ?; EMI_GROUND_TAB: ?; GENDER: ?; LATCHING: ?; MAX_CURRENT: ?; MAX_VOLTAGE: ?; NV_NAME: ?; NV_PN: ?; PACK_TYPE: ?; PATH: ?; PITCH: ?; PLACEMENT_NOTE: ?; REFLOW: ?; SHIELDED: ?; SHROUDED: ?; SKU: COMMON; Value: FPC_15P_1MM_LIE; Part Type: FPC座; PCB Footprint: FPC_15_1D0_LIE
J16 = CAM_31P: SMD  上下接触  卧式  31PIN  0.3mm脚距  后翻盖H1.0  FH35C-31S-0.3SHW(50)  镀金  广濑  ROHS; Part Reference: J16; Part Number: A1J06.00002; PCB Footprint: FPC_31P_0d3_LIE; Value: CAM_31P; Part Type: FPC座
Q2 = MOSFET_NPN: SMD  编带  SOT-323  2SK3018  N沟道  长晶  ROHS; Part Reference: Q2; Part Number: A1D01.00007; Temp Coeff: -55℃ to ＋150℃; Value: 2SK3018; Part Type: 三极管-MOS管; PCB Footprint: SOT_323
Q3 = MOSFET_NPN: SMD  编带  SOT-323  2SK3018  N沟道  长晶  ROHS; Part Reference: Q3; Part Number: A1D01.00007; Temp Coeff: -55℃ to ＋150℃; Value: 2SK3018; Part Type: 三极管-MOS管; PCB Footprint: SOT_323
Q19 = MOSFET_NPN: SMD  编带  SOT-323  2SK3018  N沟道  长晶  ROHS; Part Reference: Q19; Part Number: A1D01.00007; Temp Coeff: -55℃ to ＋150℃; Value: 2SK3018; Part Type: 三极管-MOS管; PCB Footprint: SOT_323
Q20 = MOSFET_NPN: SMD  编带  SOT-323  2SK3018  N沟道  长晶  ROHS; Part Reference: Q20; Part Number: A1D01.00007; Temp Coeff: -55℃ to ＋150℃; Value: 2SK3018; Part Type: 三极管-MOS管; PCB Footprint: SOT_323
R8 = R: SMD  0201  10K  1/20W  ±5%  ROHS; Part Reference: R8; Part Number: A1R01.00012; PCB Footprint: R0201; Preferred: 6715f349cd0bc5; Temp Coeff: -55℃ to +125℃; Value: 10K 5%; Part Type: 贴片电阻
R9 = R: SMD  0201  10K  1/20W  ±5%  ROHS; Part Reference: R9; Part Number: A1R01.00012; PCB Footprint: R0201; Preferred: 6715f349cd0bc5; Temp Coeff: -55℃ to +125℃; Value: 10K 5%; Part Type: 贴片电阻
R10 = R: SMD  0201  0R  1/20W  ±5%  ROHS; Part Reference: R10; Part Number: A1R01.00027; PCB Footprint: R0201; Temp Coeff: -55℃ to +125℃; Preferred: 6715f349cd0bc5; Value: NC; Part Type: 贴片电阻
R11 = R: SMD  0201  10K  1/20W  ±5%  ROHS; Part Reference: R11; Part Number: A1R01.00012; PCB Footprint: R0201; Preferred: 6715f349cd0bc5; Temp Coeff: -55℃ to +125℃; Value: 10K 5%; Part Type: 贴片电阻
R12 = R: SMD  0201  10K  1/20W  ±5%  ROHS; Part Reference: R12; Part Number: A1R01.00012; PCB Footprint: R0201; Preferred: 6715f349cd0bc5; Temp Coeff: -55℃ to +125℃; Value: 10K 5%; Part Type: 贴片电阻
R13 = R: SMD  0201  0R  1/20W  ±5%  ROHS; Part Reference: R13; Part Number: A1R01.00027; PCB Footprint: R0201; Temp Coeff: -55℃ to +125℃; Preferred: 6715f349cd0bc5; Value: NC; Part Type: 贴片电阻
R211 = R: SMD  0201  10K  1/20W  ±5%  ROHS; Part Reference: R211; Part Number: A1R01.00012; PCB Footprint: R0201; Preferred: 6715f349cd0bc5; Temp Coeff: -55℃ to +125℃; Value: 10K 5%; Part Type: 贴片电阻
R212 = R: SMD  0201  10K  1/20W  ±5%  ROHS; Part Reference: R212; Part Number: A1R01.00012; PCB Footprint: R0201; Preferred: 6715f349cd0bc5; Temp Coeff: -55℃ to +125℃; Value: 10K 5%; Part Type: 贴片电阻
R264 = R_Dup1: SMD  0201  10K  1/20W  ±5%  ROHS; PARTS: 1; Part Reference: R264; Part Number: A1R01.00012; LEVEL: STD; PKG_TYPE: 2; PINSWAP: (A,B); OriginalSymbolOrigin: (10,20); ROOM: DC-IRIS; Grade: B; Approved: 已承认; Temp Coeff: -55℃ to +125℃; Preferred: 6715f349cd0bc5; Value: NC/10K 5%; Part Type: 贴片电阻; PCB Footprint: R0201
R266 = R: SMD  0201  0R  1/20W  ±5%  ROHS; Part Reference: R266; Part Number: A1R01.00027; PCB Footprint: R0201; Temp Coeff: -55℃ to +125℃; Preferred: 6715f349cd0bc5; Value: NC; Part Type: 贴片电阻
R267 = R: SMD  0201  0R  1/20W  ±5%  ROHS; Part Reference: R267; Part Number: A1R01.00027; PCB Footprint: R0201; Temp Coeff: -55℃ to +125℃; Preferred: 6715f349cd0bc5; Value: NC; Part Type: 贴片电阻
R268 = R: SMD  0201  0R  1/20W  ±5%  ROHS; Part Reference: R268; Part Number: A1R01.00027; PCB Footprint: R0201; Preferred: 6715f349cd0bc5; Temp Coeff: -55℃ to +125℃; Value: NC; Part Type: 贴片电阻
R269 = R: SMD  0201  0R  1/20W  ±5%  ROHS; Part Reference: R269; Part Number: A1R01.00027; PCB Footprint: R0201; Preferred: 6715f349cd0bc5; Temp Coeff: -55℃ to +125℃; Value: NC; Part Type: 贴片电阻
R270 = R: SMD  0201  10K  1/20W  ±5%  ROHS; Part Reference: R270; Part Number: A1R01.00012; PCB Footprint: R0201; Preferred: 6715f349cd0bc5; Temp Coeff: -55℃ to +125℃; Value: 10K 5%; Part Type: 贴片电阻
R271 = R: SMD  0201  10K  1/20W  ±5%  ROHS; Part Reference: R271; Part Number: A1R01.00012; PCB Footprint: R0201; Preferred: 6715f349cd0bc5; Temp Coeff: -55℃ to +125℃; Value: 10K 5%; Part Type: 贴片电阻
R272 = R: SMD  0201  0R  1/20W  ±5%  ROHS; Part Reference: R272; Part Number: A1R01.00027; PCB Footprint: R0201; Temp Coeff: -55℃ to +125℃; Preferred: 6715f349cd0bc5; Value: NC; Part Type: 贴片电阻
Y1 = OSC_4P_V: SMD  有源  3225  27MHz  3.3V  ±10ppm  晶灏  3N27.000E33YCG  ROHS; Part Reference: Y1; Part Number: A1Y01.00074; Preferred: 6715f349cd0bc5; Temp Coeff: -40℃ to +85℃; PCB Footprint: OSC_SM4_3D2X2D5; Value: 27MHz_3.3V_10ppm; Part Type: 晶振
*#15 = radxa_1010: Page Create Date: March  8, 1995; Page Size: =PageSize; Page Modify Date: =ModifiedDate

## Sheet 18 USB2_USB3.SchDoc: CM4 IO
size 297 x 209 mm; Page Create Date: March  8, 1995; Page Number: 18; Page Size: A4; Comment: radxa_1010; Page Count: 19; RevCode: V1.10; Doc: 18 USB2/USB3; DsnPath: D:\WMS\黄工\[RC126]CM4_IO_V1.10\[RC126]_V1.10\CM4 IO_V1.10.DSN; SchematicName: CM4 IO V1.10; PageName: 18 USB2/USB3; PageSize: A4; TopSchematic: True
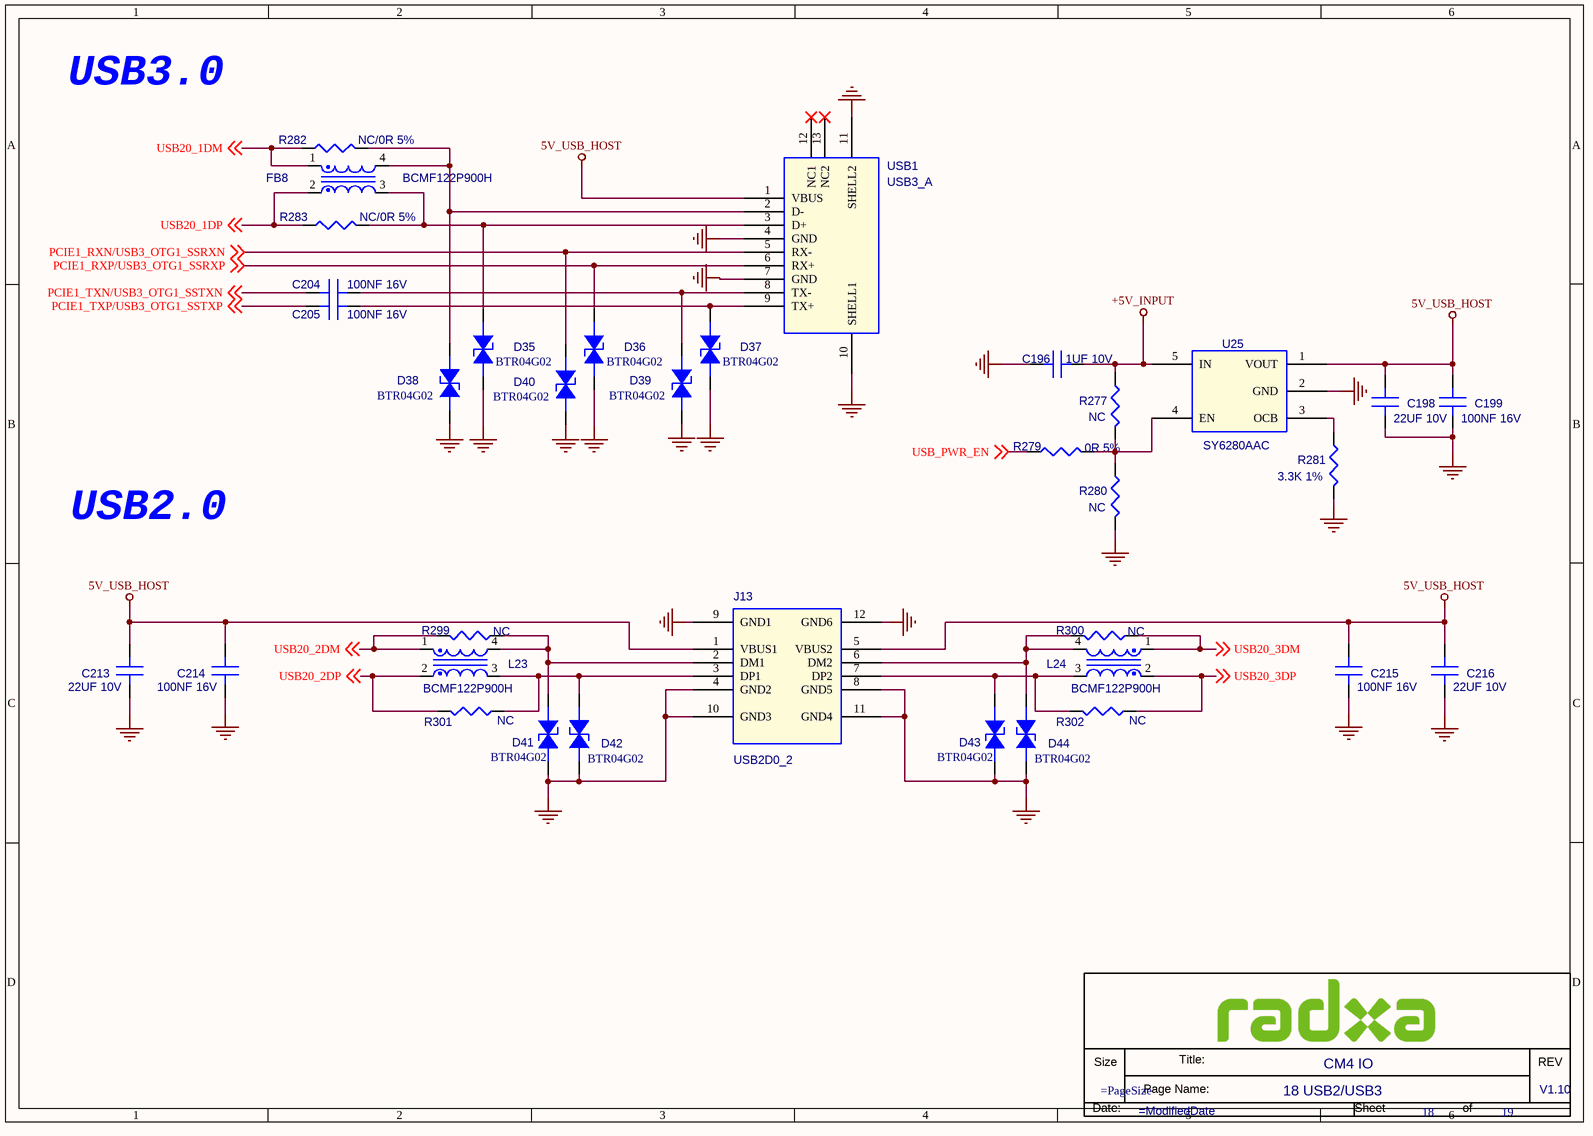
[diagram p15: 18 USB2_USB3.SchDoc]

### Parts
(Parts that share a designator on the sheet are numbered #1, #2 ... from top to bottom, then left to right.)
*#16  Doc: 18 USB2/USB3  RevCode: V1.10  Title: CM4 IO  Page Number: 18  Page Count: 19  (hidden comment: radxa_1010)  (graphical)
C196  1UF 10V  [C0201]
C198  22UF 10V  [C0603]
C199  100NF 16V  [C0201]
C204  100NF 16V  [C0201]
C205  100NF 16V  [C0201]
C213  22UF 10V  [C0603]
C214  100NF 16V  [C0201]
C215  100NF 16V  [C0201]
C216  22UF 10V  [C0603]
D35  BTR04G02  [DFN1006-2L]
D36  BTR04G02  [DFN1006-2L]
D37  BTR04G02  [DFN1006-2L]
D38  BTR04G02  [DFN1006-2L]
D39  BTR04G02  [DFN1006-2L]
D40  BTR04G02  [DFN1006-2L]
D41  BTR04G02  [DFN1006-2L]
D42  BTR04G02  [DFN1006-2L]
D43  BTR04G02  [DFN1006-2L]
D44  BTR04G02  [DFN1006-2L]
FB8  BCMF122P900H  [LC1210]
J13  USB2D0_2  [CON_USB2D0_TH1X2_LIE]
L23  BCMF122P900H  [LC1210]
L24  BCMF122P900H  [LC1210]
R277  NC  [R0402]
R279  0R 5%  [R0402]
R280  NC  [R0402]
R281  3.3K 1%  [R0402]
R282  NC/0R 5%  [R0402]
R283  NC/0R 5%  [R0402]
R299  NC  [R0402]
R300  NC  [R0402]
R301  NC  [R0402]
R302  NC  [R0402]
U25  SY6280AAC  [SOT23_5]
USB1  USB3_A  [USB_SM9_2D0_LIE]

### Nets
5V_USB_HOST: C198.1(A) C199.1(A) C213.1(A) C214.1(A) C215.1(A) C216.1(A) J13.1(VBUS1) J13.5(VBUS2) U25.1(VOUT) USB1.1(VBUS)
+5V_INPUT: C196.1(A) R277.1 U25.5(IN)
GND: C196.2(B) C198.2(B) C199.2(B) C213.2(B) C214.2(B) C215.2(B) C216.2(B) D35.1(ANODE) D36.1(ANODE) D37.1(ANODE) D38.1(ANODE) D39.1(ANODE) D40.1(ANODE) D41.1(ANODE) D42.1(ANODE) D43.1(ANODE) D44.1(ANODE) J13.4(GND2) J13.8(GND5) J13.9(GND1) J13.10(GND3) J13.11(GND4) J13.12(GND6) R280.2 R281.2 U25.2(GND) USB1.4(GND) USB1.7(GND) USB1.10(SHELL1) USB1.11(SHELL2)
PCIE1_RXN/USB3_OTG1_SSRXN: D40.2(CATHODE) USB1.5(RX-) ; off-sheet PCIE1_RXN/USB3_OTG1_SSRXN
PCIE1_RXP/USB3_OTG1_SSRXP: D36.2(CATHODE) USB1.6(RX+) ; off-sheet PCIE1_RXP/USB3_OTG1_SSRXP
PCIE1_TXN/USB3_OTG1_SSTXN: C204.1(A) ; off-sheet PCIE1_TXN/USB3_OTG1_SSTXN
PCIE1_TXP/USB3_OTG1_SSTXP: C205.1(A) ; off-sheet PCIE1_TXP/USB3_OTG1_SSTXP
USB20_1DM: FB8.1 R282.2 ; off-sheet USB20_1DM
USB20_1DP: FB8.2 R283.2 ; off-sheet USB20_1DP
USB20_2DM: L23.1 R299.1 ; off-sheet USB20_2DM
USB20_2DP: L23.2 R301.1 ; off-sheet USB20_2DP
USB20_3DM: L24.1 R300.1 ; off-sheet USB20_3DM
USB20_3DP: L24.2 R302.1 ; off-sheet USB20_3DP
USB_PWR_EN: R279.2 ; off-sheet USB_PWR_EN
NetC204_2: C204.2(B) D39.2(CATHODE) USB1.8(TX-)
NetC205_2: C205.2(B) D37.2(CATHODE) USB1.9(TX+)
NetD35_2: D35.2(CATHODE) FB8.3 R283.1 USB1.3(D+)
NetD38_2: D38.2(CATHODE) FB8.4 R282.1 USB1.2(D-)
NetD41_2: D41.2(CATHODE) J13.2(DM1) L23.4 R299.2
NetD42_2: D42.2(CATHODE) J13.3(DP1) L23.3 R301.2
NetD43_2: D43.2(CATHODE) J13.7(DP2) L24.3 R302.2
NetD44_2: D44.2(CATHODE) J13.6(DM2) L24.4 R300.2
NetR277_2: R277.2 R279.1 R280.1 U25.4(EN)
NetR281_1: R281.1 U25.3(OCB)

Not connected (* = marked no-connect by the designer): USB1 12(NC1)* 13(NC2)*

### Notes on the sheet
- USB3.0
- USB2.0
- (in symbol radxa_1010) Size; Title:; REV; Page Name:; Date:; Sheet; of

### Library data of the parts
C196 = C: SMD  0201  1UF  10V  X5R  ±20%  ROHS; PARTS: 1; Part Reference: C196; Part Number: A1C01.00081; OriginalSymbolOrigin: (0,30); PKG_TYPE: CAP2-100-250; LEVEL: STD; PINSWAP: (A,B); Value: 1UF 10V; Part Type: 陶瓷电容; PCB Footprint: C0201
C198 = C: SMD  0603  22UF  10V  X5R  ±20%  ROHS; PARTS: 1; Part Reference: C198; Part Number: A1C01.00015; OriginalSymbolOrigin: (0,30); PKG_TYPE: CAP2-100-250; LEVEL: STD; PINSWAP: (A,B); Value: 22UF 10V; Part Type: 陶瓷电容; PCB Footprint: C0603
C199 = C: SMD  0201  100NF  16V  X5R  ±20%  ROHS; PARTS: 1; Part Reference: C199; Part Number: A1C01.00099; OriginalSymbolOrigin: (0,30); PKG_TYPE: CAP2-100-250; LEVEL: STD; PINSWAP: (A,B); Preferred: 6715f349cd0bc5; Value: 100NF 16V; Part Type: 陶瓷电容
C204 = C: SMD  0201  100NF  16V  X5R  ±20%  ROHS; PARTS: 1; Part Reference: C204; Part Number: A1C01.00099; OriginalSymbolOrigin: (0,30); PKG_TYPE: CAP2-100-250; LEVEL: STD; PINSWAP: (A,B); Preferred: 6715f349cd0bc5; Value: 100NF 16V; Part Type: 陶瓷电容
C205 = C: SMD  0201  100NF  16V  X5R  ±20%  ROHS; PARTS: 1; Part Reference: C205; Part Number: A1C01.00099; OriginalSymbolOrigin: (0,30); PKG_TYPE: CAP2-100-250; LEVEL: STD; PINSWAP: (A,B); Preferred: 6715f349cd0bc5; Value: 100NF 16V; Part Type: 陶瓷电容
C213 = C: SMD  0603  22UF  10V  X5R  ±20%  ROHS; PARTS: 1; Part Reference: C213; Part Number: A1C01.00015; OriginalSymbolOrigin: (0,30); PKG_TYPE: CAP2-100-250; LEVEL: STD; PINSWAP: (A,B); Value: 22UF 10V; Part Type: 陶瓷电容; PCB Footprint: C0603
C214 = C: SMD  0201  100NF  16V  X5R  ±20%  ROHS; PARTS: 1; Part Reference: C214; Part Number: A1C01.00099; OriginalSymbolOrigin: (0,30); PKG_TYPE: CAP2-100-250; LEVEL: STD; PINSWAP: (A,B); Preferred: 6715f349cd0bc5; Value: 100NF 16V; Part Type: 陶瓷电容
C215 = C: SMD  0201  100NF  16V  X5R  ±20%  ROHS; PARTS: 1; Part Reference: C215; Part Number: A1C01.00099; OriginalSymbolOrigin: (0,30); PKG_TYPE: CAP2-100-250; LEVEL: STD; PINSWAP: (A,B); Preferred: 6715f349cd0bc5; Value: 100NF 16V; Part Type: 陶瓷电容
C216 = C: SMD  0603  22UF  10V  X5R  ±20%  ROHS; PARTS: 1; Part Reference: C216; Part Number: A1C01.00015; OriginalSymbolOrigin: (0,30); PKG_TYPE: CAP2-100-250; LEVEL: STD; PINSWAP: (A,B); Value: 22UF 10V; Part Type: 陶瓷电容; PCB Footprint: C0603
D35 = ESD: SMD  编带  0402  BTR04G02  B-tron  ROHS; Part Reference: D35; Part Number: A1D02.00002; Parameter: ESD-台舟 ESD5341N-封装 esd0402; ID: DE-E0004; Temp Coeff: -50℃ ~ +125℃; PCB Footprint: ESD_D0402; Value: BTR04G02; Part Type: 二极管-ESD管-桥堆-TVS管
D36 = ESD: SMD  编带  0402  BTR04G02  B-tron  ROHS; Part Reference: D36; Part Number: A1D02.00002; Parameter: ESD-台舟 ESD5341N-封装 esd0402; ID: DE-E0004; Temp Coeff: -50℃ ~ +125℃; PCB Footprint: ESD_D0402; Value: BTR04G02; Part Type: 二极管-ESD管-桥堆-TVS管
D37 = ESD: SMD  编带  0402  BTR04G02  B-tron  ROHS; Part Reference: D37; Part Number: A1D02.00002; Parameter: ESD-台舟 ESD5341N-封装 esd0402; ID: DE-E0004; Temp Coeff: -50℃ ~ +125℃; PCB Footprint: ESD_D0402; Value: BTR04G02; Part Type: 二极管-ESD管-桥堆-TVS管
D38 = ESD: SMD  编带  0402  BTR04G02  B-tron  ROHS; Part Reference: D38; Part Number: A1D02.00002; Parameter: ESD-台舟 ESD5341N-封装 esd0402; ID: DE-E0004; Temp Coeff: -50℃ ~ +125℃; PCB Footprint: ESD_D0402; Value: BTR04G02; Part Type: 二极管-ESD管-桥堆-TVS管
D39 = ESD: SMD  编带  0402  BTR04G02  B-tron  ROHS; Part Reference: D39; Part Number: A1D02.00002; Parameter: ESD-台舟 ESD5341N-封装 esd0402; ID: DE-E0004; Temp Coeff: -50℃ ~ +125℃; PCB Footprint: ESD_D0402; Value: BTR04G02; Part Type: 二极管-ESD管-桥堆-TVS管
D40 = ESD: SMD  编带  0402  BTR04G02  B-tron  ROHS; Part Reference: D40; Part Number: A1D02.00002; Parameter: ESD-台舟 ESD5341N-封装 esd0402; ID: DE-E0004; Temp Coeff: -50℃ ~ +125℃; PCB Footprint: ESD_D0402; Value: BTR04G02; Part Type: 二极管-ESD管-桥堆-TVS管
D41 = ESD: SMD  编带  0402  BTR04G02  B-tron  ROHS; Part Reference: D41; Part Number: A1D02.00002; Parameter: ESD-台舟 ESD5341N-封装 esd0402; ID: DE-E0004; Temp Coeff: -50℃ ~ +125℃; PCB Footprint: ESD_D0402; Value: BTR04G02; Part Type: 二极管-ESD管-桥堆-TVS管
D42 = ESD: SMD  编带  0402  BTR04G02  B-tron  ROHS; Part Reference: D42; Part Number: A1D02.00002; Parameter: ESD-台舟 ESD5341N-封装 esd0402; ID: DE-E0004; Temp Coeff: -50℃ ~ +125℃; PCB Footprint: ESD_D0402; Value: BTR04G02; Part Type: 二极管-ESD管-桥堆-TVS管
D43 = ESD: SMD  编带  0402  BTR04G02  B-tron  ROHS; Part Reference: D43; Part Number: A1D02.00002; Parameter: ESD-台舟 ESD5341N-封装 esd0402; ID: DE-E0004; Temp Coeff: -50℃ ~ +125℃; PCB Footprint: ESD_D0402; Value: BTR04G02; Part Type: 二极管-ESD管-桥堆-TVS管
D44 = ESD: SMD  编带  0402  BTR04G02  B-tron  ROHS; Part Reference: D44; Part Number: A1D02.00002; Parameter: ESD-台舟 ESD5341N-封装 esd0402; ID: DE-E0004; Temp Coeff: -50℃ ~ +125℃; PCB Footprint: ESD_D0402; Value: BTR04G02; Part Type: 二极管-ESD管-桥堆-TVS管
FB8 = MCZ1210AH900L2: SMD  BCMF122P900H  90R  4PIN  不带ESD  ±5%  B-tron  ROHS; Part Reference: FB8; Part Number: A1L03.00003; PCB Footprint: CML_SM4_0D6_1D5; Value: BCMF122P900H; Part Type: 共模电感
J13 = USB2D0_2: DIP  USB2.0母座  双层  卷边无定位柱  黑色胶芯  17.5*14.4*H15.6mm  90度弯脚  弯脚固定间距15.6mm  铜壳  BUSF082B1N12438  兴联  耐高温  ROHS; Part Reference: J13; Part Number: A1J08.00050; Preferred: 6715f349cd0bc5; Temp Coeff: -25℃ to +105℃; Value: USB2D0_2; Part Type: USB座; PCB Footprint: CON_USB2D0_TH1X2_LIE
L23 = MCZ1210AH900L2: SMD  BCMF122P900H  90R  4PIN  不带ESD  ±5%  B-tron  ROHS; Part Reference: L23; Part Number: A1L03.00003; PCB Footprint: CML_SM4_0D6_1D5; Value: BCMF122P900H; Part Type: 共模电感
L24 = MCZ1210AH900L2: SMD  BCMF122P900H  90R  4PIN  不带ESD  ±5%  B-tron  ROHS; Part Reference: L24; Part Number: A1L03.00003; PCB Footprint: CML_SM4_0D6_1D5; Value: BCMF122P900H; Part Type: 共模电感
R277 = R: SMD  0201  6.8K  1/20W  ±1%  ROHS; Part Reference: R277; Part Number: A1R01.00158; PCB Footprint: R0201; Value: NC; Part Type: 贴片电阻
R279 = R: SMD  0201  1K  1/20W  ±5%  ROHS; Part Reference: R279; Part Number: A1R01.00018; PCB Footprint: R0201; Value: 0R 5%; Part Type: 贴片电阻
R280 = R: SMD  0201  6.8K  1/20W  ±1%  ROHS; Part Reference: R280; Part Number: A1R01.00158; PCB Footprint: R0201; Value: NC; Part Type: 贴片电阻
R281 = R: SMD  0201  3.3K  1/20W  ±1%  ROHS; Part Reference: R281; Part Number: A1R01.00178; PCB Footprint: R0201; Value: 3.3K 1%; Part Type: 贴片电阻
R282 = R: SMD  0201  0R  1/20W  ±5%  ROHS; Part Reference: R282; Part Number: A1R01.00027; PCB Footprint: R0201; Temp Coeff: －55℃ ~ ＋125℃; Value: NC/0R 5%; Part Type: 贴片电阻
R283 = R: SMD  0201  0R  1/20W  ±5%  ROHS; Part Reference: R283; Part Number: A1R01.00027; PCB Footprint: R0201; Temp Coeff: －55℃ ~ ＋125℃; Value: NC/0R 5%; Part Type: 贴片电阻
R299 = R: SMD  0201  0R  1/20W  ±5%  ROHS; Part Reference: R299; Part Number: A1R01.00027; PCB Footprint: R0201; Temp Coeff: －55℃ ~ ＋125℃; Value: NC; Part Type: 贴片电阻
R300 = R: SMD  0201  0R  1/20W  ±5%  ROHS; Part Reference: R300; Part Number: A1R01.00027; PCB Footprint: R0201; Temp Coeff: －55℃ ~ ＋125℃; Value: NC; Part Type: 贴片电阻
R301 = R: SMD  0201  0R  1/20W  ±5%  ROHS; Part Reference: R301; Part Number: A1R01.00027; PCB Footprint: R0201; Temp Coeff: －55℃ ~ ＋125℃; Value: NC; Part Type: 贴片电阻
R302 = R: SMD  0201  0R  1/20W  ±5%  ROHS; Part Reference: R302; Part Number: A1R01.00027; PCB Footprint: R0201; Temp Coeff: －55℃ ~ ＋125℃; Value: NC; Part Type: 贴片电阻
U25 = SY6280: SMD  USB限流  SY6280AAC  SOT23-5  silergy(矽力杰)  ROHS; Part Reference: U25; Part Number: A1I01.00017; PCB Footprint: SOT23_5; Value: SY6280AAC; Part Type: 集成电路/模块
USB1 = USB3_A: SMD  USB3.0母座  单层  直边无定位柱  蓝色胶芯  14.5*13*H6.8mm  90度弯脚  直脚固定间距12.6mm  5001-01010011A  文章济美  鱼叉脚  脚长2.7mm  ROHS; Part Reference: USB1; Part Number: A1J08.00010; PCB Footprint: USB_SM9_2D0_LIE; Value: USB3_A; Part Type: USB座
*#16 = radxa_1010: Page Create Date: March  8, 1995; Page Size: =PageSize; Page Modify Date: =ModifiedDate

## Sheet 19 PCIE.SchDoc: CM4 IO
size 297 x 209 mm; Page Create Date: March  8, 1995; Page Number: 19; Page Size: A4; Comment: radxa_1010; Page Count: 19; RevCode: V1.10; Doc: 19 PCIE; DsnPath: D:\WMS\黄工\[RC126]CM4_IO_V1.10\[RC126]_V1.10\CM4 IO_V1.10.DSN; SchematicName: CM4 IO V1.10; PageName: 19 PCIE; PageSize: A4; TopSchematic: True
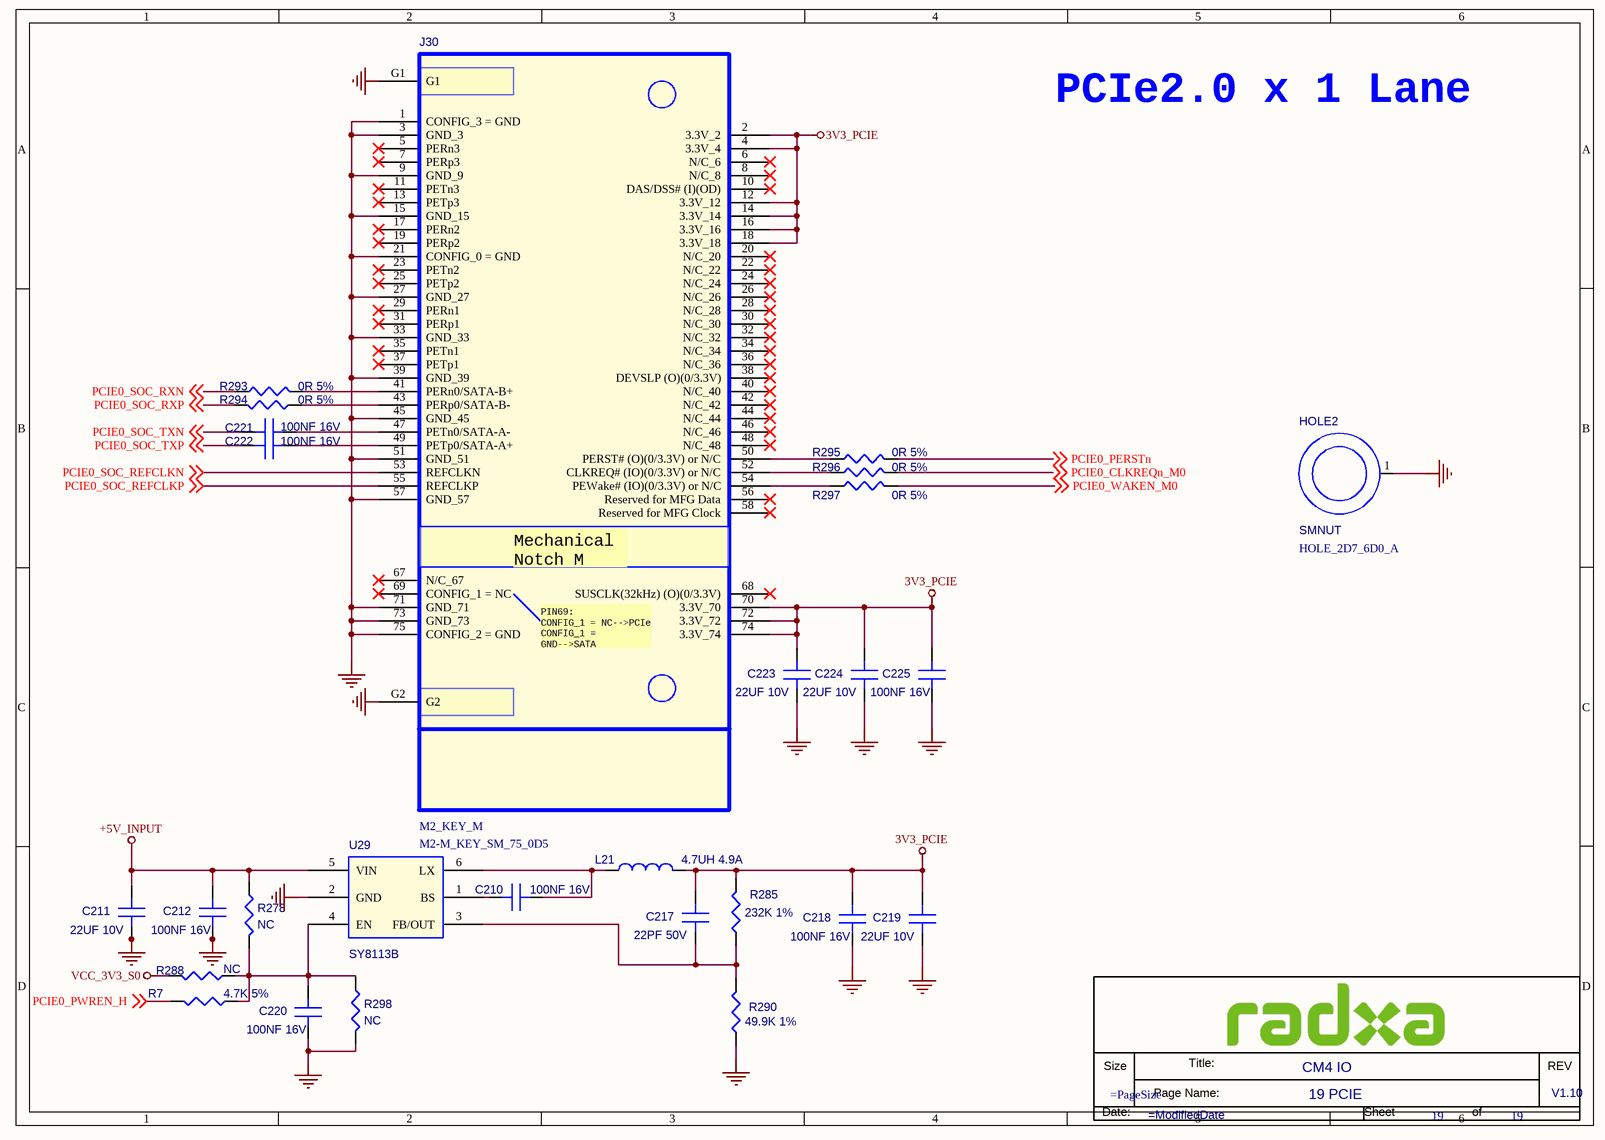
[diagram p16: 19 PCIE.SchDoc]

### Parts
(Parts that share a designator on the sheet are numbered #1, #2 ... from top to bottom, then left to right.)
*#17  Doc: 19 PCIE  RevCode: V1.10  Title: CM4 IO  Page Number: 19  (hidden comment: radxa_1010)  (graphical)
C210  100NF 16V  [C0201]
C211  22UF 10V  [C0603]
C212  100NF 16V  [C0201]
C217  22PF 50V  [C0201]
C218  100NF 16V  [C0201]
C219  22UF 10V  [C0603]
C220  100NF 16V  [C0201]
C221  100NF 16V  [C0201]
C222  100NF 16V  [C0201]
C223  22UF 10V  [C0603]
C224  22UF 10V  [C0603]
C225  100NF 16V  [C0201]
HOLE2  SMNUT  [HOLE_2D7_6D0_A]
J30  M2_KEY_M  [M2-M_KEY_SM_75_0D5]
L21  4.7UH 4.9A  [L_4020]
R7  4.7K 5%  [R0402]
R278  NC  [R0402]
R285  232K 1%  [R0402]
R288  NC  [R0402]
R290  49.9K 1%  [R0402]
R293  0R 5%  [R0402]
R294  0R 5%  [R0402]
R295  0R 5%  [R0402]
R296  0R 5%  [R0402]
R297  0R 5%  [R0402]
R298  NC  [R0402]
U29  SY8113B  [SOT23_6]

### Nets
3V3_PCIE: C217.1(A) C218.1(A) C219.1(A) C223.1(A) C224.1(A) C225.1(A) J30.2(3.3V_2) J30.4(3.3V_4) J30.12(3.3V_12) J30.14(3.3V_14) J30.16(3.3V_16) J30.18(3.3V_18) J30.70(3.3V_70) J30.72(3.3V_72) J30.74(3.3V_74) L21.2 R285.1
+5V_INPUT: C211.1(A) C212.1(A) R278.2 U29.5(VIN)
GND: C211.2(B) C212.2(B) C218.2(B) C219.2(B) C220.2(B) C223.2(B) C224.2(B) C225.2(B) HOLE2.1 J30.1(CONFIG_3_=_GND) J30.3(GND_3) J30.9(GND_9) J30.15(GND_15) J30.21(CONFIG_0_=_GND) J30.27(GND_27) J30.33(GND_33) J30.39(GND_39) J30.45(GND_45) J30.51(GND_51) J30.57(GND_57) J30.71(GND_71) J30.73(GND_73) J30.75(CONFIG_2_=_GND) J30.G1 J30.G2 R290.2 R298.1 U29.2(GND)
VCC_3V3_S0: R288.1
PCIE0_CLKREQn_M0: R296.2 ; off-sheet PCIE0_CLKREQn_M0
PCIE0_PERSTn: R295.2 ; off-sheet PCIE0_PERSTn
PCIE0_PWREN_H: R7.1 ; off-sheet PCIE0_PWREN_H
PCIE0_SOC_REFCLKN: J30.53(REFCLKN) ; off-sheet PCIE0_SOC_REFCLKN
PCIE0_SOC_REFCLKP: J30.55(REFCLKP) ; off-sheet PCIE0_SOC_REFCLKP
PCIE0_SOC_RXN: R293.1 ; off-sheet PCIE0_SOC_RXN
PCIE0_SOC_RXP: R294.1 ; off-sheet PCIE0_SOC_RXP
PCIE0_SOC_TXN: C221.1(A) ; off-sheet PCIE0_SOC_TXN
PCIE0_SOC_TXP: C222.1(A) ; off-sheet PCIE0_SOC_TXP
PCIE0_WAKEN_M0: R297.2 ; off-sheet PCIE0_WAKEN_M0
NetC210_1: C210.1(A) U29.1(BS)
NetC210_2: C210.2(B) L21.1 U29.6(LX)
NetC217_2: C217.2(B) R285.2 R290.1 U29.3(FB/OUT)
NetC220_1: C220.1(A) R7.2 R278.1 R288.2 R298.2 U29.4(EN)
NetC221_2: C221.2(B) J30.47(PETn0/SATA-A-)
NetC222_2: C222.2(B) J30.49(PETp0/SATA-A+)
NetJ30_41: J30.41(PERn0/SATA-B+) R293.2
NetJ30_43: J30.43(PERp0/SATA-B-) R294.2
NetJ30_50: J30.50(PERST#_(O)(0/3.3V)_or_N/C) R295.1
NetJ30_52: J30.52(CLKREQ#_(IO)(0/3.3V)_or_N/C) R296.1
NetJ30_54: J30.54(PEWake#_(IO)(0/3.3V)_or_N/C) R297.1

Not connected (* = marked no-connect by the designer): J30 5(PERn3)* 6(N/C_6)* 7(PERp3)* 8(N/C_8)* 10(DAS/DSS#_(I)(OD))* 11(PETn3)* 13(PETp3)* 17(PERn2)* 19(PERp2)* 20(N/C_20)* 22(N/C_22)* 23(PETn2)* 24(N/C_24)* 25(PETp2)* 26(N/C_26)* 28(N/C_28)* 29(PERn1)* 30(N/C_30)* 31(PERp1)* 32(N/C_32)* 34(N/C_34)* 35(PETn1)* 36(N/C_36)* 37(PETp1)* 38(DEVSLP_(O)(0/3.3V))* 40(N/C_40)* 42(N/C_42)* 44(N/C_44)* 46(N/C_46)* 48(N/C_48)* 56(Reserved_for_MFG_Data)* 58(Reserved_for_MFG_Clock)* 67(N/C_67)* 68(SUSCLK(32kHz)_(O)(0/3.3V))* 69(CONFIG_1_=_NC)*

### Notes on the sheet
- PCIe2.0 x 1 Lane
- (in symbol M2_KEY_M) Mechanical / Notch M; PIN69: / CONFIG_1 = NC-->PCIe / CONFIG_1 = / GND-->SATA
- (in symbol radxa_1010) Size; Title:; REV; Page Name:; Date:; Sheet; of

### Library data of the parts
C210 = C: SMD  0201  100NF  16V  X5R  ±20%  ROHS; PARTS: 1; Part Reference: C210; Part Number: A1C01.00099; OriginalSymbolOrigin: (0,30); PKG_TYPE: CAP2-100-250; LEVEL: STD; PINSWAP: (A,B); Preferred: 6715f349cd0bc5; Value: 100NF 16V; Part Type: 陶瓷电容
C211 = C: SMD  0603  22UF  10V  X5R  ±10%  ROHS; PARTS: 1; Part Reference: C211; Part Number: A1C01.00296; OriginalSymbolOrigin: (0,30); PKG_TYPE: CAP2-100-250; LEVEL: STD; PINSWAP: (A,B); Value: 22UF 10V; PCB Footprint: C0603; Part Type: 陶瓷电容
C212 = C: SMD  0201  100NF  16V  X5R  ±20%  ROHS; PARTS: 1; Part Reference: C212; Part Number: A1C01.00099; OriginalSymbolOrigin: (0,30); PKG_TYPE: CAP2-100-250; LEVEL: STD; PINSWAP: (A,B); Preferred: 6715f349cd0bc5; Value: 100NF 16V; Part Type: 陶瓷电容
C217 = C: SMD  0201  22PF  50V  NPO  ±5%  ROHS; PARTS: 1; Part Reference: C217; Part Number: A1C01.00021; OriginalSymbolOrigin: (0,30); PKG_TYPE: CAP2-100-250; LEVEL: STD; PINSWAP: (A,B); Value: 22PF 50V; PCB Footprint: C0201; Part Type: 陶瓷电容
C218 = C: SMD  0201  100NF  16V  X5R  ±20%  ROHS; PARTS: 1; Part Reference: C218; Part Number: A1C01.00099; OriginalSymbolOrigin: (0,30); PKG_TYPE: CAP2-100-250; LEVEL: STD; PINSWAP: (A,B); Preferred: 6715f349cd0bc5; Value: 100NF 16V; Part Type: 陶瓷电容
C219 = C: SMD  0603  22UF  10V  X5R  ±10%  ROHS; PARTS: 1; Part Reference: C219; Part Number: A1C01.00296; OriginalSymbolOrigin: (0,30); PKG_TYPE: CAP2-100-250; LEVEL: STD; PINSWAP: (A,B); Value: 22UF 10V; PCB Footprint: C0603; Part Type: 陶瓷电容
C220 = C: SMD  0201  100NF  16V  X5R  ±20%  ROHS; PARTS: 1; Part Reference: C220; Part Number: A1C01.00099; OriginalSymbolOrigin: (0,30); PKG_TYPE: CAP2-100-250; LEVEL: STD; PINSWAP: (A,B); Preferred: 6715f349cd0bc5; Value: 100NF 16V; Part Type: 陶瓷电容
C221 = C: SMD  0201  100NF  16V  X5R  ±20%  ROHS; PARTS: 1; Part Reference: C221; Part Number: A1C01.00099; OriginalSymbolOrigin: (0,30); PKG_TYPE: CAP2-100-250; LEVEL: STD; PINSWAP: (A,B); Preferred: 6715f349cd0bc5; Value: 100NF 16V; Part Type: 陶瓷电容
C222 = C: SMD  0201  100NF  16V  X5R  ±20%  ROHS; PARTS: 1; Part Reference: C222; Part Number: A1C01.00099; OriginalSymbolOrigin: (0,30); PKG_TYPE: CAP2-100-250; LEVEL: STD; PINSWAP: (A,B); Preferred: 6715f349cd0bc5; Value: 100NF 16V; Part Type: 陶瓷电容
C223 = C: SMD  0603  22UF  10V  X5R  ±10%  ROHS; PARTS: 1; Part Reference: C223; Part Number: A1C01.00296; OriginalSymbolOrigin: (0,30); PKG_TYPE: CAP2-100-250; LEVEL: STD; PINSWAP: (A,B); Value: 22UF 10V; PCB Footprint: C0603; Part Type: 陶瓷电容
C224 = C: SMD  0603  22UF  10V  X5R  ±10%  ROHS; PARTS: 1; Part Reference: C224; Part Number: A1C01.00296; OriginalSymbolOrigin: (0,30); PKG_TYPE: CAP2-100-250; LEVEL: STD; PINSWAP: (A,B); Value: 22UF 10V; PCB Footprint: C0603; Part Type: 陶瓷电容
C225 = C: SMD  0201  100NF  16V  X5R  ±20%  ROHS; PARTS: 1; Part Reference: C225; Part Number: A1C01.00099; OriginalSymbolOrigin: (0,30); PKG_TYPE: CAP2-100-250; LEVEL: STD; PINSWAP: (A,B); Preferred: 6715f349cd0bc5; Value: 100NF 16V; Part Type: 陶瓷电容
HOLE2 = SMNUT: SMD  编带  M2  通孔  一端?5mm  高6.6mm  另一端?2.5mm  高1.5mm  总高8.8mm  (带定位台阶φ2.5mm 高度0.7mm 贴高温胶纸)  适配H8.5高M.2座  铜  镀锡  DDSMT20241011288  ROHS; Part Reference: HOLE2; Part Number: A1S01.00008; Temp Coeff: -40℃ to +150℃; Preferred: 6715f349cd0bc5; Value: SMNUT; Part Type: 表贴螺母; PCB Footprint: HOLE_2D7_6D0_A
J30 = M2_KEY_M: SMD  母座  75PIN  180度  0.5mm脚距  M.2  M KEY  H8.5  黑色  ROHS; Part Reference: J30; Part Number: A1J01.00045; Parameter: 连接器-比派-封装 M2_KEY_M; Value: M2_KEY_M; Part Type: 连接座; PCB Footprint: M2-M_KEY_SM_75_0D5
L21 = L: SMD  带屏蔽  4*4*2mm  4.7UH  4.9A  ±20%  RXWHJ4020-4R7MT  ROHS; Part Reference: L21; Part Number: A1L01.00026; PCB Footprint: L_4020; Value: 4.7UH 4.9A; Part Type: 贴片功率电感
R7 = R: SMD  0201  4.7K  1/20W  ±5%  ROHS; Part Reference: R7; Part Number: A1R01.00014; PCB Footprint: R0201; Preferred: 6715f349cd0bc5; Temp Coeff: -55℃ to +125℃; Value: 4.7K 5%; Part Type: 贴片电阻
R278 = R: SMD  0201  10K  1/20W  ±5%  ROHS; Part Reference: R278; Part Number: A1R01.00012; PCB Footprint: R0201; Temp Coeff: －55℃ ~ ＋125℃; Value: NC; Part Type: 贴片电阻
R285 = R: SMD  0201  232K  1/20W  ±1%  ROHS; Part Reference: R285; Part Number: A1R01.00189; PCB Footprint: R0201; Value: 232K 1%; Part Type: 贴片电阻
R288 = R: SMD  0201  10K  1/20W  ±5%  ROHS; Part Reference: R288; Part Number: A1R01.00012; PCB Footprint: R0201; Temp Coeff: －55℃ ~ ＋125℃; Value: NC; Part Type: 贴片电阻
R290 = R: SMD  0201  49.9K  1/20W  ±1%  ROHS; Part Reference: R290; Part Number: A1R01.00207; PCB Footprint: R0201; Value: 49.9K 1%; Part Type: 贴片电阻
R293 = R: SMD  0201  0R  1/20W  ±5%  ROHS; Part Reference: R293; Part Number: A1R01.00027; PCB Footprint: R0201; Temp Coeff: －55℃ ~ ＋125℃; Value: 0R 5%; Part Type: 贴片电阻
R294 = R: SMD  0201  0R  1/20W  ±5%  ROHS; Part Reference: R294; Part Number: A1R01.00027; PCB Footprint: R0201; Temp Coeff: －55℃ ~ ＋125℃; Value: 0R 5%; Part Type: 贴片电阻
R295 = R: SMD  0201  0R  1/20W  ±5%  ROHS; Part Reference: R295; Part Number: A1R01.00027; PCB Footprint: R0201; Temp Coeff: －55℃ ~ ＋125℃; Value: 0R 5%; Part Type: 贴片电阻
R296 = R: SMD  0201  0R  1/20W  ±5%  ROHS; Part Reference: R296; Part Number: A1R01.00027; PCB Footprint: R0201; Temp Coeff: －55℃ ~ ＋125℃; Value: 0R 5%; Part Type: 贴片电阻
R297 = R: SMD  0201  0R  1/20W  ±5%  ROHS; Part Reference: R297; Part Number: A1R01.00027; PCB Footprint: R0201; Temp Coeff: －55℃ ~ ＋125℃; Value: 0R 5%; Part Type: 贴片电阻
R298 = R: SMD  0201  10K  1/20W  ±5%  ROHS; Part Reference: R298; Part Number: A1R01.00012; PCB Footprint: R0201; Temp Coeff: －55℃ ~ ＋125℃; Value: NC; Part Type: 贴片电阻
U29 = SY8113B: SMD  DCDC  SY8113BADC  SOT23-6  silergy(矽力杰)  ROHS; Part Reference: U29; Part Number: A1I01.00093; PCB Footprint: SOT23_6; Value: SY8113B; Part Type: 集成电路/模块
*#17 = radxa_1010: Page Create Date: March  8, 1995; Page Size: =PageSize; Page Count: 19; Page Modify Date: =ModifiedDate